# Altium project main.PrjPcb (part 1 of 2)
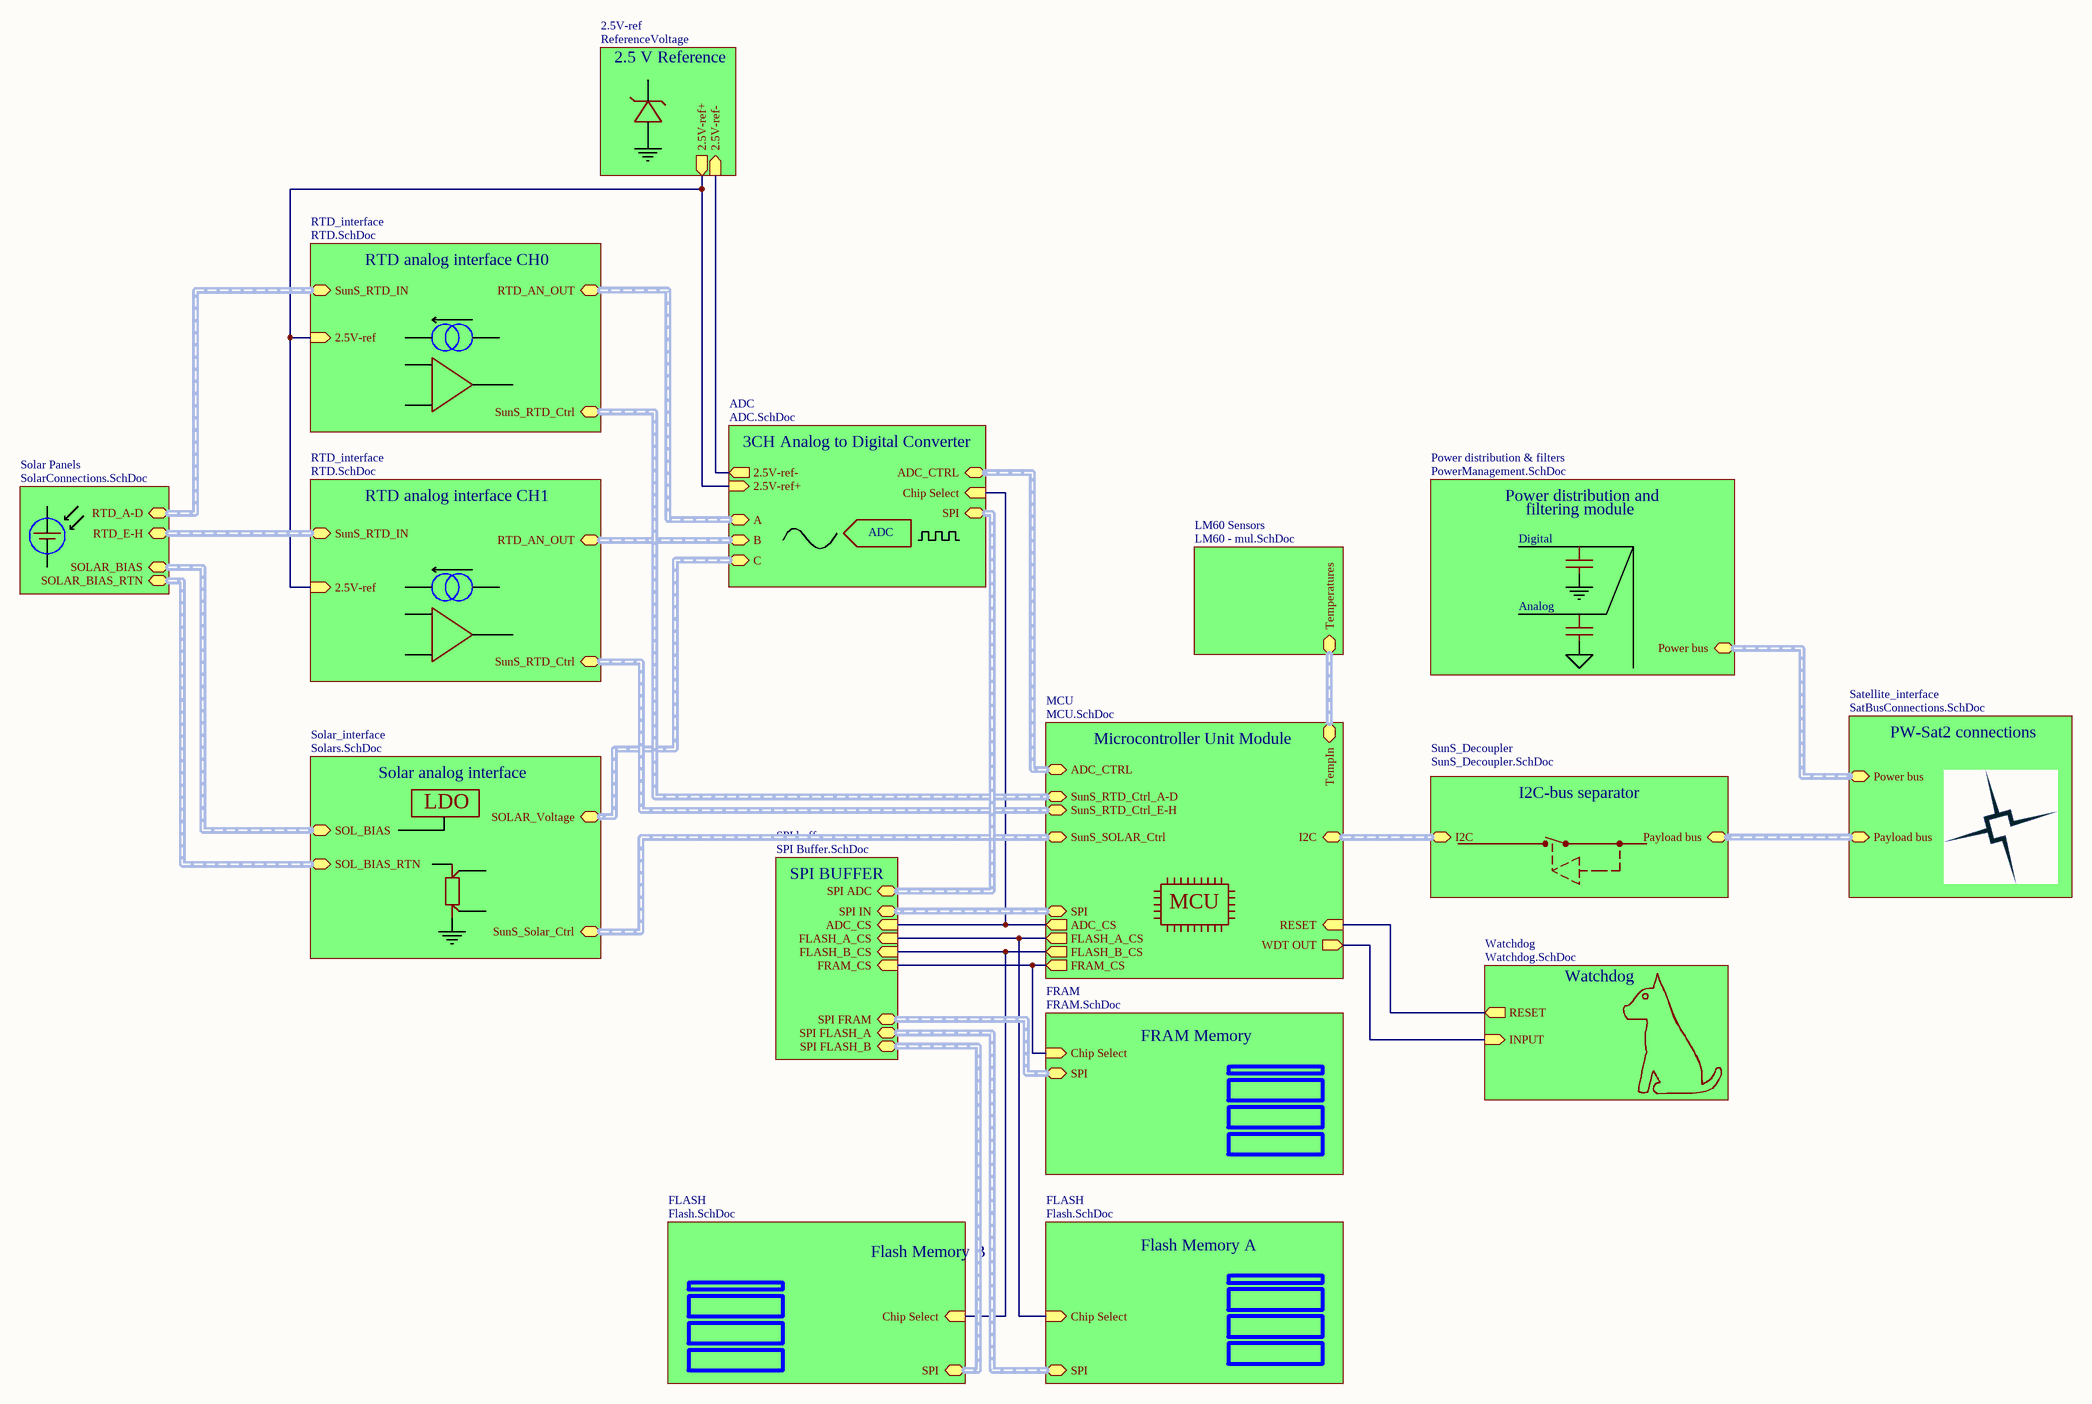
[diagram p0: Top.SchDoc]
17 sheets, 278 parts. Net scope: hierarchical (ports join the sheet entries above them; power ports are global).
Board file: main.PcbDoc
Sheets:
  Top.SchDoc
    MCU = MCU.SchDoc
    Solar Panels = SolarConnections.SchDoc
    Satellite_interface = SatBusConnections.SchDoc
    RTD_interface = RTD.SchDoc
    Solar_interface = Solars.SchDoc
      Current_Limit_CH0 = Current_Limit.SchDoc
      Current_Limit_CH1 = Current_Limit.SchDoc
      Current_Limit_CH2 = Current_Limit.SchDoc
      Current_Limit_CH3 = Current_Limit.SchDoc
    2.5V-ref = ReferenceVoltage.SchDoc
    ADC = ADC.SchDoc
    RTD_interface = RTD.SchDoc
    Power distribution & filters = PowerManagement.SchDoc
    SunS_Decoupler = SunS_Decoupler.SchDoc
    FRAM = FRAM.SchDoc
    FLASH = Flash.SchDoc
    FLASH = Flash.SchDoc
    Watchdog = Watchdog.SchDoc
    SPI buffer = SPI Buffer.SchDoc
    LM60 Sensors = LM60 - mul.SchDoc
      LM601 = LM60.SchDoc
      LM602 = LM60.SchDoc
      LM603 = LM60.SchDoc
      LM604 = LM60.SchDoc

## Sheet Top.SchDoc: SunS - General Block Diagram
size A2; Author: Grzegorz Gajoch; DocumentNumber: 10; SheetNumber: 10; SheetTotal: 16; Model: EM1; PageSetup: Record=PageOptions|CenterHorizontal=True|CenterVertical=True|PrintScale=0.73|XCorrection=1.00|YCorrection=1.00|PrintKind=1|BorderSize=5000000|LeftOffset=0|BottomOffset=0|Orientation=2|PaperLength=4200|PaperWidth=2970|Scale=100|PaperSource=15|PrintQuality=1200|MediaType=1|DitherType=10|PrintScaleMode=1|PaperKind=A3|PaperIndex=8; ResSerDig: 100

### Sub-sheets
2.5V-ref = ReferenceVoltage: 2.5V-ref+ (out), 2.5V-ref- (in)
ADC = ADC.SchDoc: ADC_CTRL (harness ADC_DIG), 2.5V-ref+ (in), 2.5V-ref- (out), A (harness ADC_IN), B (harness ADC_IN), C (harness ADC_IN), Chip Select (in), SPI (harness SPI)
FLASH = Flash.SchDoc: SPI (harness SPI), Chip Select (in)
FLASH = Flash.SchDoc: SPI (harness SPI), Chip Select (in)
FRAM = FRAM.SchDoc: SPI (harness SPI), Chip Select (in)
LM60 Sensors = LM60 - mul.SchDoc: Temperatures (harness LM60)
MCU = MCU.SchDoc: SunS_RTD_Ctrl_A-D (harness MUX_Control), I2C (harness I2C), SunS_RTD_Ctrl_E-H (harness MUX_Control), ADC_CTRL (harness ADC_DIG), SPI (harness SPI), FRAM_CS (out), ADC_CS (out), FLASH_A_CS (out), FLASH_B_CS (out), RESET (in), WDT OUT (out), SunS_SOLAR_Ctrl (harness SunS_Solar_Ctrl), TempIn (harness LM60)
Power distribution & filters = PowerManagement.SchDoc: Power bus (harness Sat_Power)
RTD_interface = RTD.SchDoc: 2.5V-ref (in), SunS_RTD_Ctrl (harness MUX_Control), SunS_RTD_IN (harness SunS_RTD_Conn), RTD_AN_OUT (harness ADC_IN)
RTD_interface = RTD.SchDoc: 2.5V-ref (in), SunS_RTD_Ctrl (harness MUX_Control), SunS_RTD_IN (harness SunS_RTD_Conn), RTD_AN_OUT (harness ADC_IN)
Satellite_interface = SatBusConnections.SchDoc: Payload bus (harness Payload bus), Power bus (harness Sat_Power)
Solar Panels = SolarConnections.SchDoc: RTD_A-D, SOLAR_BIAS (harness Solar_Conn), RTD_E-H, SOLAR_BIAS_RTN (harness Solar_Conn)
Solar_interface = Solars.SchDoc: SOLAR_Voltage (harness ADC_IN), SOL_BIAS (harness Solar_Conn), SunS_Solar_Ctrl (harness SunS_Solar_Ctrl), SOL_BIAS_RTN (harness Solar_Conn)
SPI buffer = SPI Buffer.SchDoc: SPI IN (harness SPI), SPI FRAM (harness SPI), SPI FLASH_A (harness SPI), SPI FLASH_B (harness SPI), SPI ADC (harness SPI), FRAM_CS (in), FLASH_B_CS (in), FLASH_A_CS (in), ADC_CS (in)
SunS_Decoupler = SunS_Decoupler.SchDoc: Payload bus (harness Payload bus), I2C (harness I2C)
Watchdog = Watchdog.SchDoc: RESET (out), INPUT (in)

### Nets
2.5V-ref: sheet RTD_interface/2.5V-ref, sheet 2.5V-ref/2.5V-ref+, sheet ADC/2.5V-ref+, sheet RTD_interface/2.5V-ref
AT_NRST: sheet MCU/RESET, sheet Watchdog/RESET
CS_ADC_I: sheet MCU/ADC_CS, sheet ADC/Chip Select, sheet SPI buffer/ADC_CS
CS_FLASH_A_I: sheet MCU/FLASH_A_CS, sheet FLASH/Chip Select, sheet SPI buffer/FLASH_A_CS
CS_FLASH_B_I: sheet MCU/FLASH_B_CS, sheet FLASH/Chip Select, sheet SPI buffer/FLASH_B_CS
CS_FRAM_I: sheet MCU/FRAM_CS, sheet FRAM/Chip Select, sheet SPI buffer/FRAM_CS
NetU4_25: sheet MCU/WDT OUT, sheet Watchdog/INPUT
(unnamed): sheet 2.5V-ref/2.5V-ref-, sheet ADC/2.5V-ref-

### Buses and harness runs
harness sheet ADC/A = sheet RTD_interface/RTD_AN_OUT
harness sheet ADC/ADC_CTRL = sheet MCU/ADC_CTRL
harness sheet ADC/B = sheet RTD_interface/RTD_AN_OUT
harness sheet ADC/C = sheet Solar_interface/SOLAR_Voltage
harness sheet ADC/SPI = sheet SPI buffer/SPI ADC
harness sheet FLASH/SPI = sheet SPI buffer/SPI FLASH_A
harness sheet FLASH/SPI = sheet SPI buffer/SPI FLASH_B
harness sheet FRAM/SPI = sheet SPI buffer/SPI FRAM
harness sheet LM60 Sensors/Temperatures = sheet MCU/TempIn
harness sheet MCU/I2C = sheet SunS_Decoupler/I2C
harness sheet MCU/SPI = sheet SPI buffer/SPI IN
harness sheet MCU/SunS_RTD_Ctrl_A-D = sheet RTD_interface/SunS_RTD_Ctrl
harness sheet MCU/SunS_RTD_Ctrl_E-H = sheet RTD_interface/SunS_RTD_Ctrl
harness sheet MCU/SunS_SOLAR_Ctrl = sheet Solar_interface/SunS_Solar_Ctrl
harness sheet Power distribution & filters/Power bus = sheet Satellite_interface/Power bus
harness sheet RTD_interface/SunS_RTD_IN = sheet Solar Panels/RTD_A-D
harness sheet RTD_interface/SunS_RTD_IN = sheet Solar Panels/RTD_E-H
harness sheet Satellite_interface/Payload bus = sheet SunS_Decoupler/Payload bus
harness sheet Solar Panels/SOLAR_BIAS = sheet Solar_interface/SOL_BIAS
harness sheet Solar Panels/SOLAR_BIAS_RTN = sheet Solar_interface/SOL_BIAS_RTN

### Notes on the sheet
- 2.5 V Reference
- RTD analog interface CH0
- 3CH Analog to Digital Converter
- RTD analog interface CH1
- ADC
- Power distribution and
- Digital
- filtering module
- Analog
- Microcontroller Unit Module
- PW-Sat2 connections
- Solar analog interface
- LDO
- I2C-bus separator
- SPI BUFFER
- MCU
- Watchdog
- FRAM Memory
- Flash Memory B
- Flash Memory A
- Title:
- Sheet:
- of
- Author:
- Model:
- File name:
- Document Number:
- Checked by:
- Iss-Rev:
- Approved by:
- Date:

## Sheet MCU.SchDoc: AVR processor
size A3; Author: Grzegorz Gajoch; DocumentNumber: 9; SheetNumber: 9; SheetTotal: 16; Model: EM1; PageSetup: Record=PageOptions|CenterHorizontal=True|CenterVertical=True|PrintScale=0.52|XCorrection=1.00|YCorrection=1.00|PrintKind=1|BorderSize=5000000|LeftOffset=0|BottomOffset=0|Orientation=2|PaperLength=4200|PaperWidth=2970|Scale=100|PaperSource=7|PrintQuality=600|MediaType=1|DitherType=10|PaperKind=A3|PrintScaleMode=1
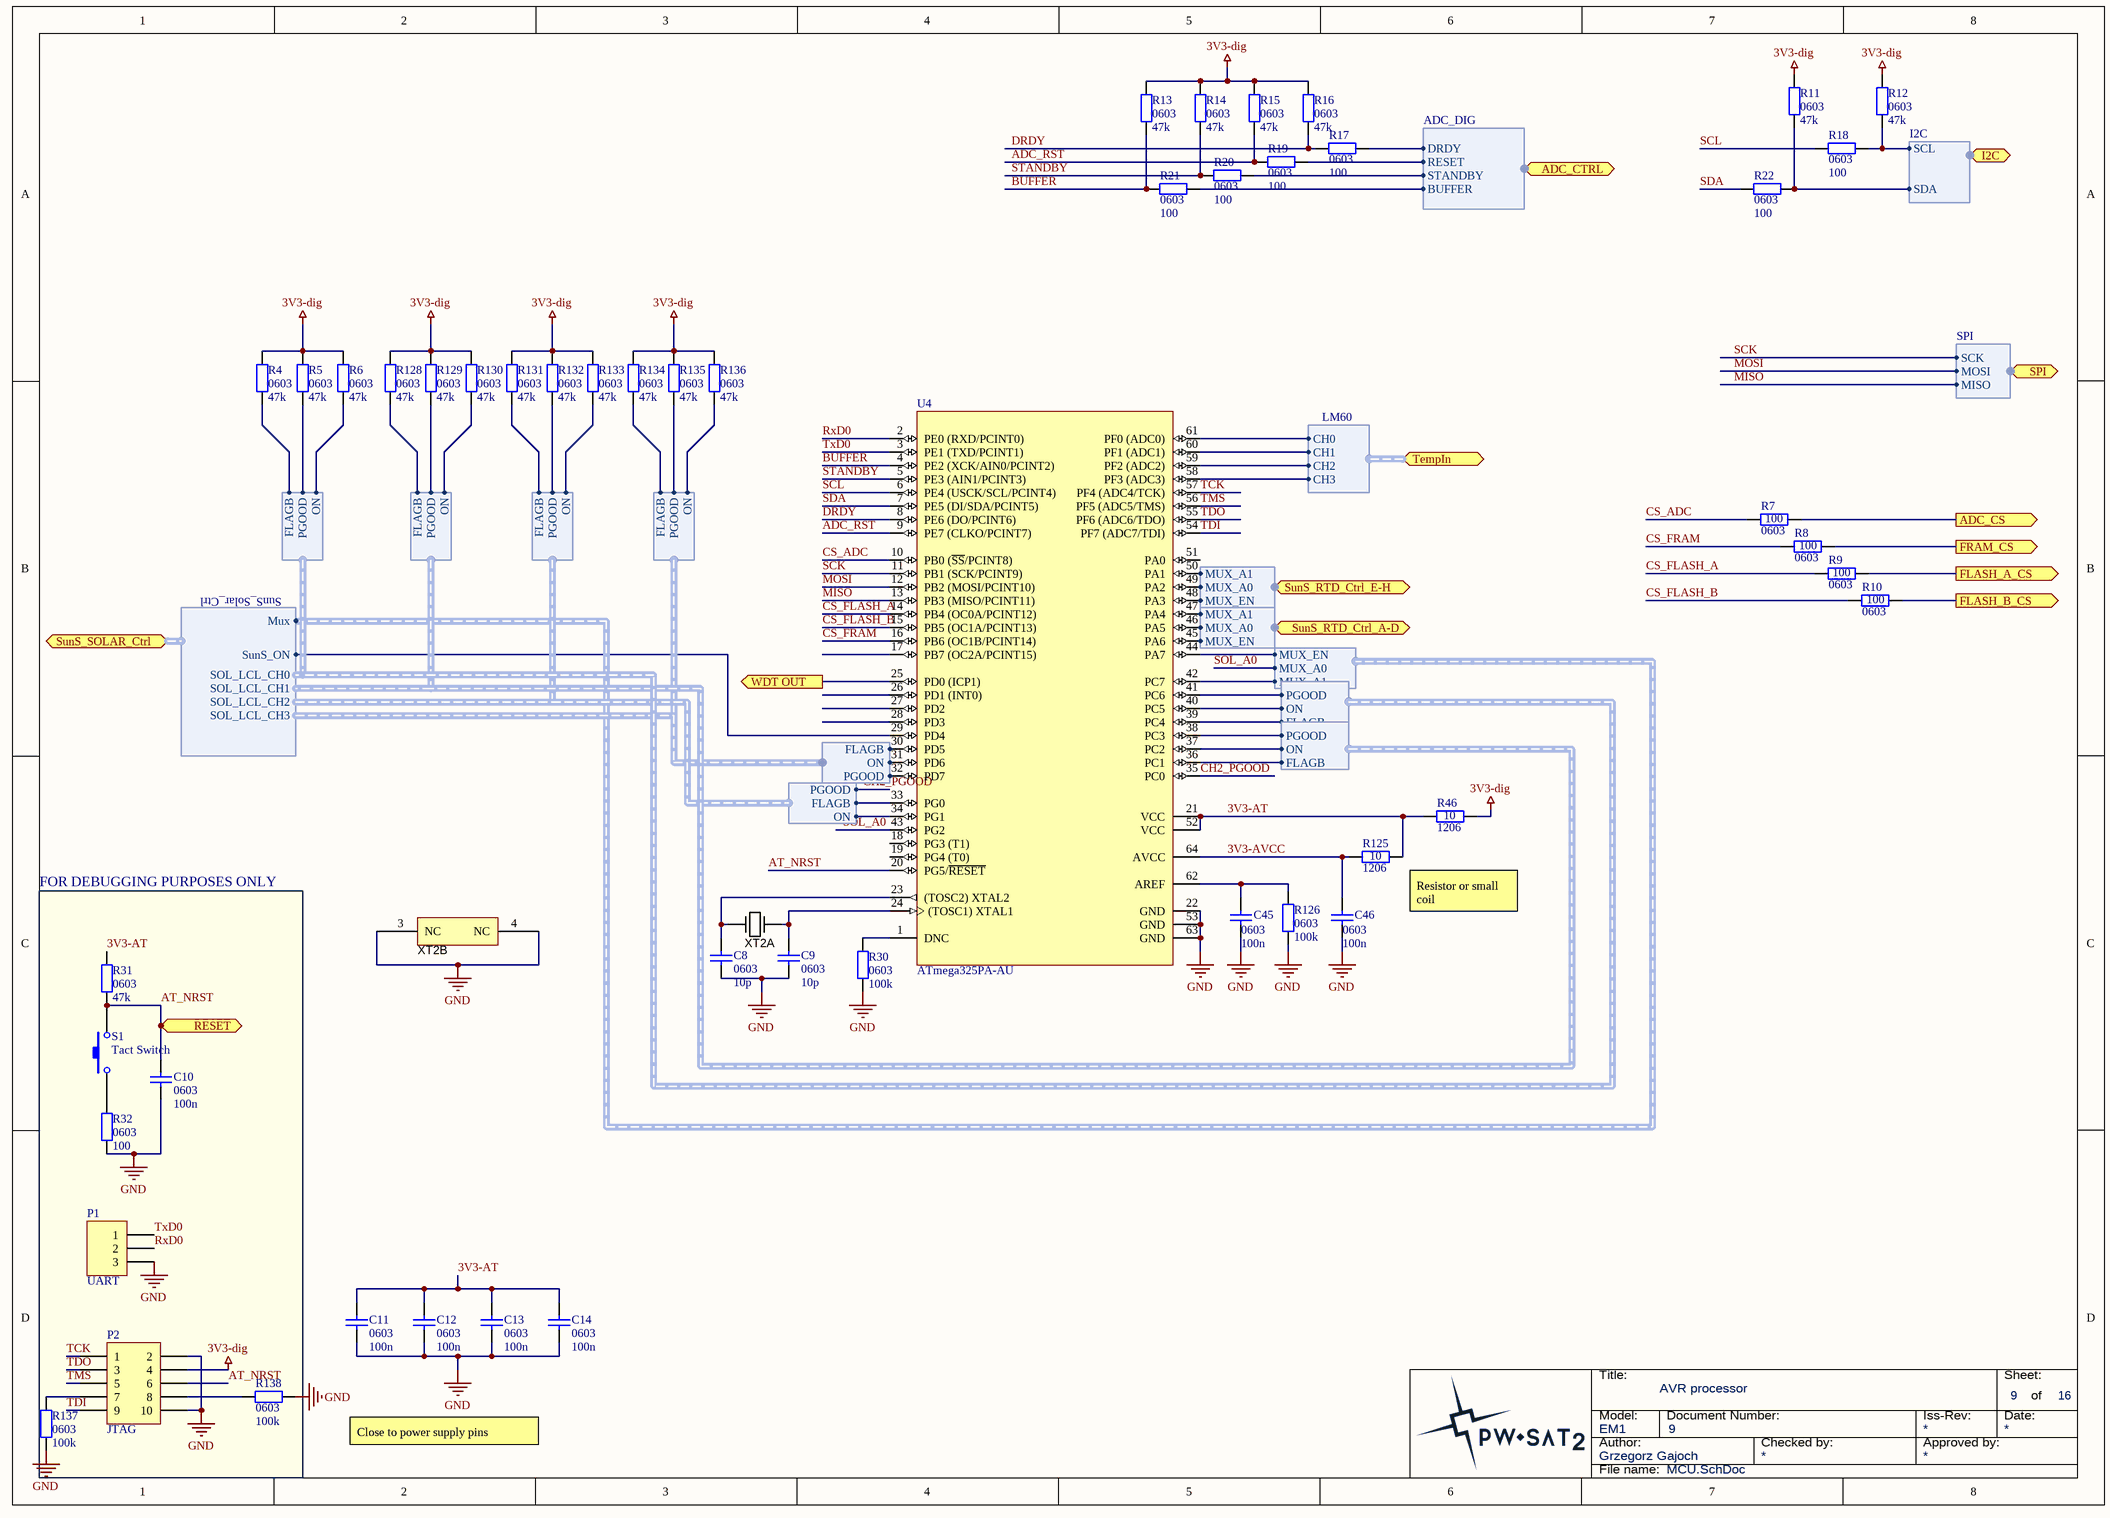
[diagram p1: MCU.SchDoc]

### Parts
C8  0603  value 10p  [SMD_Capacitor_0603]
C9  0603  value 10p  [SMD_Capacitor_0603]
C10  0603  value 100n  [SMD_Capacitor_0603]
C11  0603  value 100n  [SMD_Capacitor_0603]
C12  0603  value 100n  [SMD_Capacitor_0603]
C13  0603  value 100n  [SMD_Capacitor_0603]
C14  0603  value 100n  [SMD_Capacitor_0603]
C45  0603  value 100n  [SMD_Capacitor_0603]
C46  0603  value 100n  [SMD_Capacitor_0603]
P1  UART  [HDR1X3]
P2  JTAG  [HDR2X5]
R4  0603  value 47k  [SMD_Resistor_0603]
R5  0603  value 47k  [SMD_Resistor_0603]
R6  0603  value 47k  [SMD_Resistor_0603]
R7  0603  value 100  [SMD_Resistor_0603]
R8  0603  value 100  [SMD_Resistor_0603]
R9  0603  value 100  [SMD_Resistor_0603]
R10  0603  value 100  [SMD_Resistor_0603]
R11  0603  value 47k  [SMD_Resistor_0603]
R12  0603  value 47k  [SMD_Resistor_0603]
R13  0603  value 47k  [SMD_Resistor_0603]
R14  0603  value 47k  [SMD_Resistor_0603]
R15  0603  value 47k  [SMD_Resistor_0603]
R16  0603  value 47k  [SMD_Resistor_0603]
R17  0603  value 100  [SMD_Resistor_0603]
R18  0603  value 100  [SMD_Resistor_0603]
R19  0603  value 100  [SMD_Resistor_0603]
R20  0603  value 100  [SMD_Resistor_0603]
R21  0603  value 100  [SMD_Resistor_0603]
R22  0603  value 100  [SMD_Resistor_0603]
R30  0603  value 100k  [SMD_Resistor_0603]
R31  0603  value 47k  [SMD_Resistor_0603]
R32  0603  value 100  [SMD_Resistor_0603]
R46  1206  value 10  [SMD_Resistor_1206]
R125  1206  value 10  [SMD_Resistor_1206]
R126  0603  value 100k  [SMD_Resistor_0603]
R128  0603  value 47k  [SMD_Resistor_0603]
R129  0603  value 47k  [SMD_Resistor_0603]
R130  0603  value 47k  [SMD_Resistor_0603]
R131  0603  value 47k  [SMD_Resistor_0603]
R132  0603  value 47k  [SMD_Resistor_0603]
R133  0603  value 47k  [SMD_Resistor_0603]
R134  0603  value 47k  [SMD_Resistor_0603]
R135  0603  value 47k  [SMD_Resistor_0603]
R136  0603  value 47k  [SMD_Resistor_0603]
R137  0603  value 100k  [SMD_Resistor_0603]
R138  0603  value 100k  [SMD_Resistor_0603]
S1  Tact Switch  [Tact Switch 3x6]
U4  ATmega325PA-AU  [64A_N]
XT2  (no value)  [SMD, 5mm x 3.2mm]  (parts A,B of 2)

### Blocks framed on the sheet
FOR DEBUGGING PURPOSES ONLY: C10 P1 P2 R31 R32 R137 R138 S1

### Ports
ADC_CS (out), ADC_CTRL (harness ADC_DIG), FLASH_A_CS (out), FLASH_B_CS (out), FRAM_CS (out), I2C (harness I2C), RESET (in), SPI (harness SPI), SunS_RTD_Ctrl_A-D (harness MUX_Control), SunS_RTD_Ctrl_E-H (harness MUX_Control), SunS_SOLAR_Ctrl (harness SunS_Solar_Ctrl), TempIn (harness LM60), WDT OUT (out)

### Harnesses
MUX_Control: MUX_A0, MUX_A1, MUX_EN
I2C: SCL, SDA
SPI: MOSI, MISO, SCK
ADC_DIG: DRDY, RESET, STANDBY, BUFFER
SunS_Solar_Ctrl: Mux, SunS_ON, SOL_LCL_CH0, SOL_LCL_CH1, SOL_LCL_CH2, SOL_LCL_CH3
LCL_StatCtrl: FLAGB, PGOOD, ON
LM60: CH0, CH1, CH2, CH3

### Nets
3V3-dig: P2.4 R4.2 R5.2 R6.2 R11.2 R12.2 R13.2 R14.2 R15.2 R16.2 R46.1 R128.2 R129.2 R130.2 R131.2 R132.2 R133.2 R134.2 R135.2 R136.2  [project net Vcc3]
GND: C8.1 C9.1 C10.1 C11.1 C12.1 C13.1 C14.1 C45.1 C46.1 P1.3 P2.2 P2.10 R30.1 R32.2 R126.1 R137.1 R138.1 U4.22(GND) U4.53(GND) U4.63(GND) XT2.3(NC) XT2.4(NC)  [project net Ground1]
3V3-AT: C11.2 C12.2 C13.2 C14.2 R31.2 R46.2 R125.2 U4.21(VCC) U4.52(VCC)
3V3-AVCC: C46.2 R125.1 U4.64(AVCC)
ADC_RST: R15.1 R19.1 U4.9(PE7_(CLKO/PCINT7))
AT_NRST: C10.2 P2.6 R31.1 S1.2 U4.20(PG5/~{RESET}) ; port RESET
BUFFER: R13.1 R21.1 U4.4(PE2_(XCK/AIN0/PCINT2))
CH2_PGOOD: R132.1 U4.35(PC0) ; harness LCL_StatCtrl.PGOOD
CS_ADC: R7.2 U4.10(PB0_(~{SS}/PCINT8))
CS_ADC_I: R7.1 ; port ADC_CS
CS_FLASH_A: R9.2 U4.14(PB4_(OC0A/PCINT12))
CS_FLASH_A_I: R9.1 ; port FLASH_A_CS
CS_FLASH_B: R10.2 U4.15(PB5_(OC1A/PCINT13))
CS_FLASH_B_I: R10.1 ; port FLASH_B_CS
CS_FRAM: R8.2 U4.16(PB6_(OC1B/PCINT14))
CS_FRAM_I: R8.1 ; port FRAM_CS
DRDY: R16.1 R17.1 U4.8(PE6_(DO/PCINT6))
FLAGB: R134.1 U4.30(PD5) ; harness LCL_StatCtrl.FLAGB
FLAGB: R131.1 U4.33(PG0) ; harness LCL_StatCtrl.FLAGB  [a separate net that carries the same name]
FLAGB: R128.1 U4.36(PC1) ; harness LCL_StatCtrl.FLAGB  [a separate net that carries the same name]
FLAGB: R4.1 U4.39(PC4) ; harness LCL_StatCtrl.FLAGB  [a separate net that carries the same name]
MISO: U4.13(PB3_(MISO/PCINT11)) ; port SPI.MISO
MOSI: U4.12(PB2_(MOSI/PCINT10)) ; port SPI.MOSI
ON: R136.1 U4.31(PD6) ; harness LCL_StatCtrl.ON
ON: R133.1 U4.34(PG1) ; harness LCL_StatCtrl.ON  [a separate net that carries the same name]
ON: R130.1 U4.37(PC2) ; harness LCL_StatCtrl.ON  [a separate net that carries the same name]
ON: R6.1 U4.40(PC5) ; harness LCL_StatCtrl.ON  [a separate net that carries the same name]
PGOOD: R135.1 U4.32(PD7) ; harness LCL_StatCtrl.PGOOD
PGOOD: R129.1 U4.38(PC3) ; harness LCL_StatCtrl.PGOOD  [a separate net that carries the same name]
PGOOD: R5.1 U4.41(PC6) ; harness LCL_StatCtrl.PGOOD  [a separate net that carries the same name]
RxD0: P1.2 U4.2(PE0_(RXD/PCINT0))
SCK: U4.11(PB1_(SCK/PCINT9)) ; port SPI.SCK
SCL: R18.1 U4.6(PE4_(USCK/SCL/PCINT4))
SDA: R22.1 U4.7(PE5_(DI/SDA/PCINT5))
SOL_A0: U4.43(PG2) ; harness MUX_Control.MUX_A0
STANDBY: R14.1 R20.1 U4.5(PE3_(AIN1/PCINT3))
TCK: P2.1 U4.57(PF4_(ADC4/TCK))
TDI: P2.9 U4.54(PF7_(ADC7/TDI))
TDO: P2.3 U4.55(PF6_(ADC6/TDO))
Temp1: U4.61(PF0_(ADC0)) ; port TempIn.CH0
Temp2: U4.60(PF1_(ADC1)) ; port TempIn.CH1
Temp3: U4.59(PF2_(ADC2)) ; port TempIn.CH2
Temp4: U4.58(PF3_(ADC3)) ; port TempIn.CH3
TMS: P2.5 U4.56(PF5_(ADC5/TMS))
TxD0: P1.1 U4.3(PE1_(TXD/PCINT1))
NetC8_2: C8.2 U4.23((TOSC2)_XTAL2) XT2.1(IN)
NetC9_2: C9.2 U4.24((TOSC1)_XTAL1) XT2.2(OUT)
NetC45_2: C45.2 R126.2 U4.62(AREF)
NetP2_7: P2.7 R137.2
NetP2_8: P2.8 R138.2
NetR11_1: R11.1 R22.2 ; port I2C.SDA
NetR12_1: R12.1 R18.2 ; port I2C.SCL
NetR17_2: R17.2 ; port ADC_CTRL.DRDY
NetR19_2: R19.2 ; port ADC_CTRL.RESET
NetR20_2: R20.2 ; port ADC_CTRL.STANDBY
NetR21_2: R21.2 ; port ADC_CTRL.BUFFER
NetR30_2: R30.2 U4.1(DNC)
NetR32_1: R32.1 S1.1
NetR58_RTD_interface#1_2: U4.46(PA5) ; port SunS_RTD_Ctrl_A-D.MUX_A0
NetR58_RTD_interface#2_2: U4.49(PA2) ; port SunS_RTD_Ctrl_E-H.MUX_A0
NetR59_RTD_interface#1_2: U4.47(PA4) ; port SunS_RTD_Ctrl_A-D.MUX_A1
NetR59_RTD_interface#2_2: U4.50(PA1) ; port SunS_RTD_Ctrl_E-H.MUX_A1
NetR60_RTD_interface#1_2: U4.45(PA6) ; port SunS_RTD_Ctrl_A-D.MUX_EN
NetR60_RTD_interface#2_2: U4.48(PA3) ; port SunS_RTD_Ctrl_E-H.MUX_EN
NetR68_2: U4.42(PC7) ; harness MUX_Control.MUX_A1
NetR69_2: U4.44(PA7) ; harness MUX_Control.MUX_EN
NetR73_2: U4.29(PD4) ; port SunS_SOLAR_Ctrl.SunS_ON
NetU4_25: U4.25(PD0_(ICP1)) ; port WDT OUT

Not connected (* = marked no-connect by the designer): U4 17(PB7_(OC2A/PCINT15)) 18(PG3_(T1)) 19(PG4_(T0)) 26(PD1_(INT0)) 27(PD2) 28(PD3) 51(PA0)

### Notes on the sheet
- (near R125) Resistor or small coil
- Close to power supply pins
- Title:
- Sheet:
- of
- Author:
- Model:
- Document Number:
- Checked by:
- Iss-Rev:
- Approved by:
- Date:
- File name:

### Library data of the parts
C8 C9 = Cap1: Capacitor; Published: 8-Jun-2000; LatestRevisionDate: 17-Jul-2002; LatestRevisionNote: Re-released for DXP Platform.; PackageReference: RAD-0.3; Publisher: Altium Limited; PackageDescription: Radial Cap, Thru-Hole; 2 Leads; 0.3 in Pin Spacing
C10-C14 C45 C46 = Cap: Capacitor; Published: 8-Jun-2000; LatestRevisionDate: 17-Jul-2002; LatestRevisionNote: Re-released for DXP Platform.; PackageReference: RAD-0.3; Publisher: Altium Limited; PackageDescription: Radial Cap, Thru-Hole; 2 Leads; 0.3 in Pin Spacing
P1 = Header 3: Header, 3-Pin; LatestRevisionDate: 17-Jul-2002; LatestRevisionNote: Re-released for DXP Platform.; Publisher: Altium Limited
P2 = Header 5X2: Header, 5-Pin, Dual row; LatestRevisionDate: 17-Jul-2002; LatestRevisionNote: Re-released for DXP Platform.; Publisher: Altium Limited
R4-R22 R30-R32 R46 R125 R126 R128-R138 = Res2: Resistor; Published: 8-Jun-2000; LatestRevisionDate: 17-Jul-2002; LatestRevisionNote: Re-released for DXP Platform.; PackageReference: AXIAL-0.4; Publisher: Altium Limited; PackageDescription: Axial Device, Thru-Hole; 2 Leads; 0.4 in Pin Spacing
S1 = TactSwitch: Supplier 1: Farnell
U4 = ATmega325PA-AU: 8-bit AVR Microcontroller, 1.5-5.5V, 32KB Flash, 1KB EEPROM, 2KB SRAM, 64-pin TQFP, Industrial Grade (-40°C to 85°C); DatasheetVersion: revD, Jun-2011; PackageVersion: revC, Oct-2010; PackageReference: 64A; PackageDescription: 64-Pin Plastic Thin Profile Quad Flat Pack, 14 x 14 x 1.0 mm Body, 0.8 mm Pitch (TQFP); Code_JEDEC: MS-026-AEB; ComponentLink1Description: Manufacturer URL; ComponentLink1URL: http://www.atmel.com/; ComponentLink2Description: ATmega165A/PA/325A/PA/3250A/PA/645A/P/6450A/P Datasheet; ComponentLink2URL: http://www.atmel.com/dyn/resources/prod_documents/doc8285.pdf; ComponentLink3Description: ATmega165A/PA/325A/PA/3250A/PA/645A/P/6450A/P Summary; ComponentLink3URL: http://www.atmel.com/dyn/resources/prod_documents/8285S.pdf
XT2 = Crystal_SMD: Resonator Ceramic; Manufacturer 1: Citizen Finetech Miyota; Manufacturer Part Number 1: CMR309T-6.000MABJ-UT; Ratings: 6.00 MHz; Frequency: 6MHz; Frequency Stability: ±50ppm; Frequency Tolerance: ±30ppm; Load Capacitance: 18pF; Operating Mode: Fundamental; SCDType: spec; Package / Case: Cylindrical Can, Radial; Type: MHz Crystal; Operating Temperature: -10°C ~ 60°C; Mounting Type: Surface Mount; Size / Dimension: 0.118" Dia x 0.346" L (3.00mm x 8.80mm); Height: 0.122" (3.10mm); Supplier 1: Digi-Key; Supplier Part Number 1: 300-8348-1-ND; Tolerance: ±50ppm; ComponentLink1URL: http://media.digikey.com/pdf/Data%20Sheets/Citizen%20PDFs/CMR310T%20CMR309T.pdf; ComponentLink1Description: http://media.digikey.com/pdf/Data%20Sheets/Citizen%20PDFs/CMR310T%20CMR309T.pdf

## Sheet SolarConnections.SchDoc: Solar Panels Connections
size A4; Author: Michał Gumiela; DocumentNumber: 5; SheetNumber: 5; SheetTotal: 16; Model: EM1; PageSetup: Record=PageOptions|CenterHorizontal=True|CenterVertical=True|PrintScale=0.52|XCorrection=1.00|YCorrection=1.00|PrintKind=1|BorderSize=5000000|LeftOffset=0|BottomOffset=0|Orientation=2|PaperLength=4200|PaperWidth=2970|Scale=100|PaperSource=7|PrintQuality=600|MediaType=1|DitherType=10|PaperKind=A3|PrintScaleMode=1
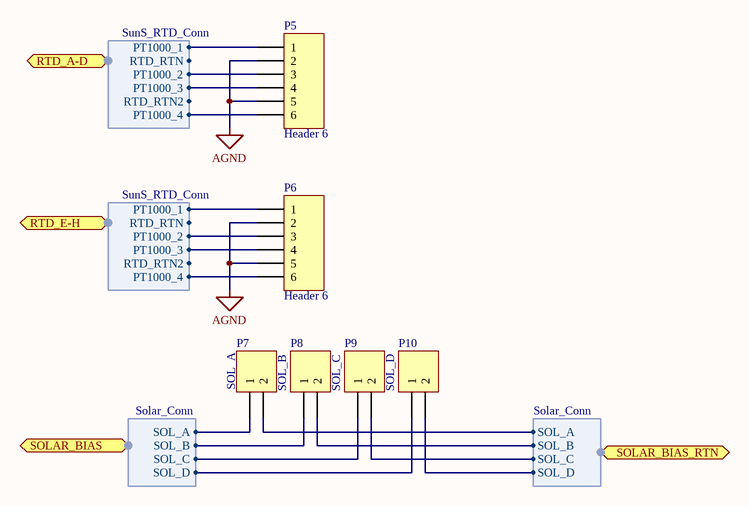
[diagram p2: SolarConnections.SchDoc]

### Parts
P5  Header 6  [HDR1X6]
P6  Header 6  [HDR1X6]
P7  SOL_A  [HDR1X2]
P8  SOL_B  [HDR1X2]
P9  SOL_C  [HDR1X2]
P10  SOL_D  [HDR1X2]

### Ports
RTD_A-D (harness SunS_RTD_Conn), RTD_E-H (harness SunS_RTD_Conn), SOLAR_BIAS (harness Solar_Conn), SOLAR_BIAS_RTN (harness Solar_Conn)

### Harnesses
Solar_Conn: SOL_A, SOL_B, SOL_C, SOL_D
SunS_RTD_Conn: PT1000_1, PT1000_2, PT1000_3, PT1000_4, RTD_RTN2, RTD_RTN

### Nets
AGND: P5.2 P5.5 P6.2 P6.5  [project net Ground1]
NetP5_1: P5.1 ; port RTD_A-D.PT1000_1
NetP5_3: P5.3 ; port RTD_A-D.PT1000_2
NetP5_4: P5.4 ; port RTD_A-D.PT1000_3
NetP5_6: P5.6 ; port RTD_A-D.PT1000_4
NetP6_1: P6.1 ; port RTD_E-H.PT1000_1
NetP6_3: P6.3 ; port RTD_E-H.PT1000_2
NetP6_4: P6.4 ; port RTD_E-H.PT1000_3
NetP6_6: P6.6 ; port RTD_E-H.PT1000_4
NetP7_1: P7.1 ; port SOLAR_BIAS.SOL_A
NetP7_2: P7.2 ; port SOLAR_BIAS_RTN.SOL_A
NetP8_1: P8.1 ; port SOLAR_BIAS.SOL_B
NetP8_2: P8.2 ; port SOLAR_BIAS_RTN.SOL_B
NetP9_1: P9.1 ; port SOLAR_BIAS.SOL_C
NetP9_2: P9.2 ; port SOLAR_BIAS_RTN.SOL_C
NetP10_1: P10.1 ; port SOLAR_BIAS.SOL_D
NetP10_2: P10.2 ; port SOLAR_BIAS_RTN.SOL_D
(unnamed): port RTD_E-H.RTD_RTN2, port RTD_E-H.RTD_RTN
(unnamed): port RTD_A-D.RTD_RTN2, port RTD_A-D.RTD_RTN

### Notes on the sheet
- Title:
- Sheet:
- of
- Author:
- Model:
- Document Number:
- Checked by:
- Iss-Rev:
- Approved by:
- Date:
- File name:

### Library data of the parts
P5 P6 = Header 6: Header, 6-Pin; LatestRevisionDate: 17-Jul-2002; LatestRevisionNote: Re-released for DXP Platform.; Publisher: Altium Limited
P7-P10 = Header 2: Header, 2-Pin; LatestRevisionDate: 17-Jul-2002; LatestRevisionNote: Re-released for DXP Platform.; Publisher: Altium Limited

## Sheet SatBusConnections.SchDoc: SunS - PW-Sat2 connections
size A3; Author: Michał Gumiela; DocumentNumber: 16; SheetNumber: 16; SheetTotal: 16; Model: EM1; PageSetup: Record=PageOptions|CenterHorizontal=True|CenterVertical=True|PrintScale=0.52|XCorrection=1.00|YCorrection=1.00|PrintKind=1|BorderSize=5000000|LeftOffset=0|BottomOffset=0|Orientation=2|PaperLength=4200|PaperWidth=2970|Scale=100|PaperSource=7|PrintQuality=600|MediaType=1|DitherType=10|PaperKind=A3|PrintScaleMode=1
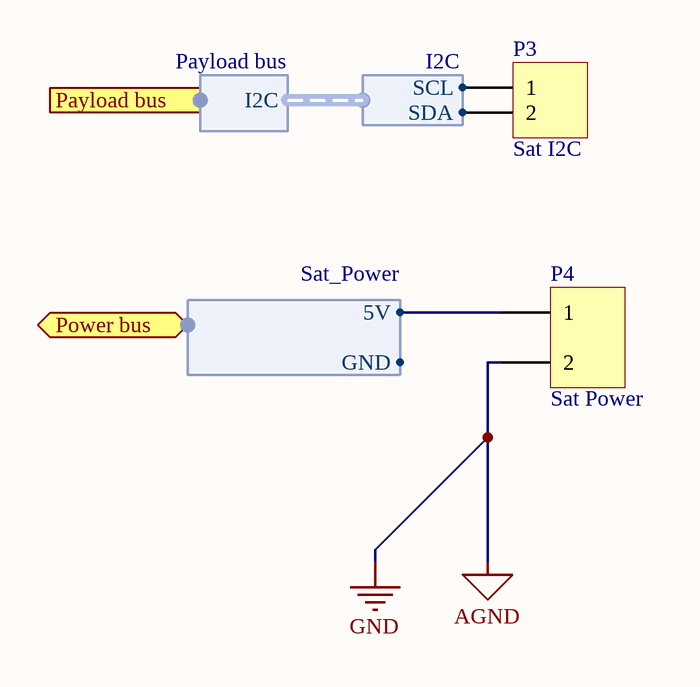
[diagram p3: SatBusConnections.SchDoc]

### Parts
P3  Sat I2C  [HDR1X2]
P4  Sat Power  [HDR1X3]

### Ports
Payload bus (harness Payload bus), Power bus (harness Sat_Power)

### Harnesses
I2C: SCL, SDA
Payload bus: I2C
Sat_Power: 5V, GND

### Nets
AGND: P4.3(2)  [also labelled GND]  [project net Ground1]
5V: P4.1 ; port Power bus.5V
NetP3_1: P3.1 ; harness I2C.SCL
NetP3_2: P3.2 ; harness I2C.SDA

Not connected (* = marked no-connect by the designer): P4 2

### Notes on the sheet
- Title:
- Sheet:
- of
- Author:
- Model:
- Document Number:
- Checked by:
- Iss-Rev:
- Approved by:
- Date:
- File name:

### Library data of the parts
P3 = Header 2: Header, 2-Pin; LatestRevisionDate: 17-Jul-2002; LatestRevisionNote: Re-released for DXP Platform.; Publisher: Altium Limited
P4 = Header 3: Header, 3-Pin; LatestRevisionDate: 17-Jul-2002; LatestRevisionNote: Re-released for DXP Platform.; Publisher: Altium Limited

## Sheet RTD.SchDoc: RTD analog interface
size A3; Author: M. Gumiela, G. Gajoch; DocumentNumber: 2; SheetNumber: 2; SheetTotal: 16; Model: EM1; PageSetup: Record=PageOptions|CenterHorizontal=True|CenterVertical=True|PrintScale=0.52|XCorrection=1.00|YCorrection=1.00|PrintKind=1|BorderSize=5000000|LeftOffset=0|BottomOffset=0|Orientation=2|PaperLength=4200|PaperWidth=2970|Scale=100|PaperSource=7|PrintQuality=600|MediaType=1|DitherType=10|PaperKind=A3|PrintScaleMode=1
Used 2 times, as channels RTD_interface, RTD_interface. Parts and nets are listed once, with the designators drawn on the sheet.
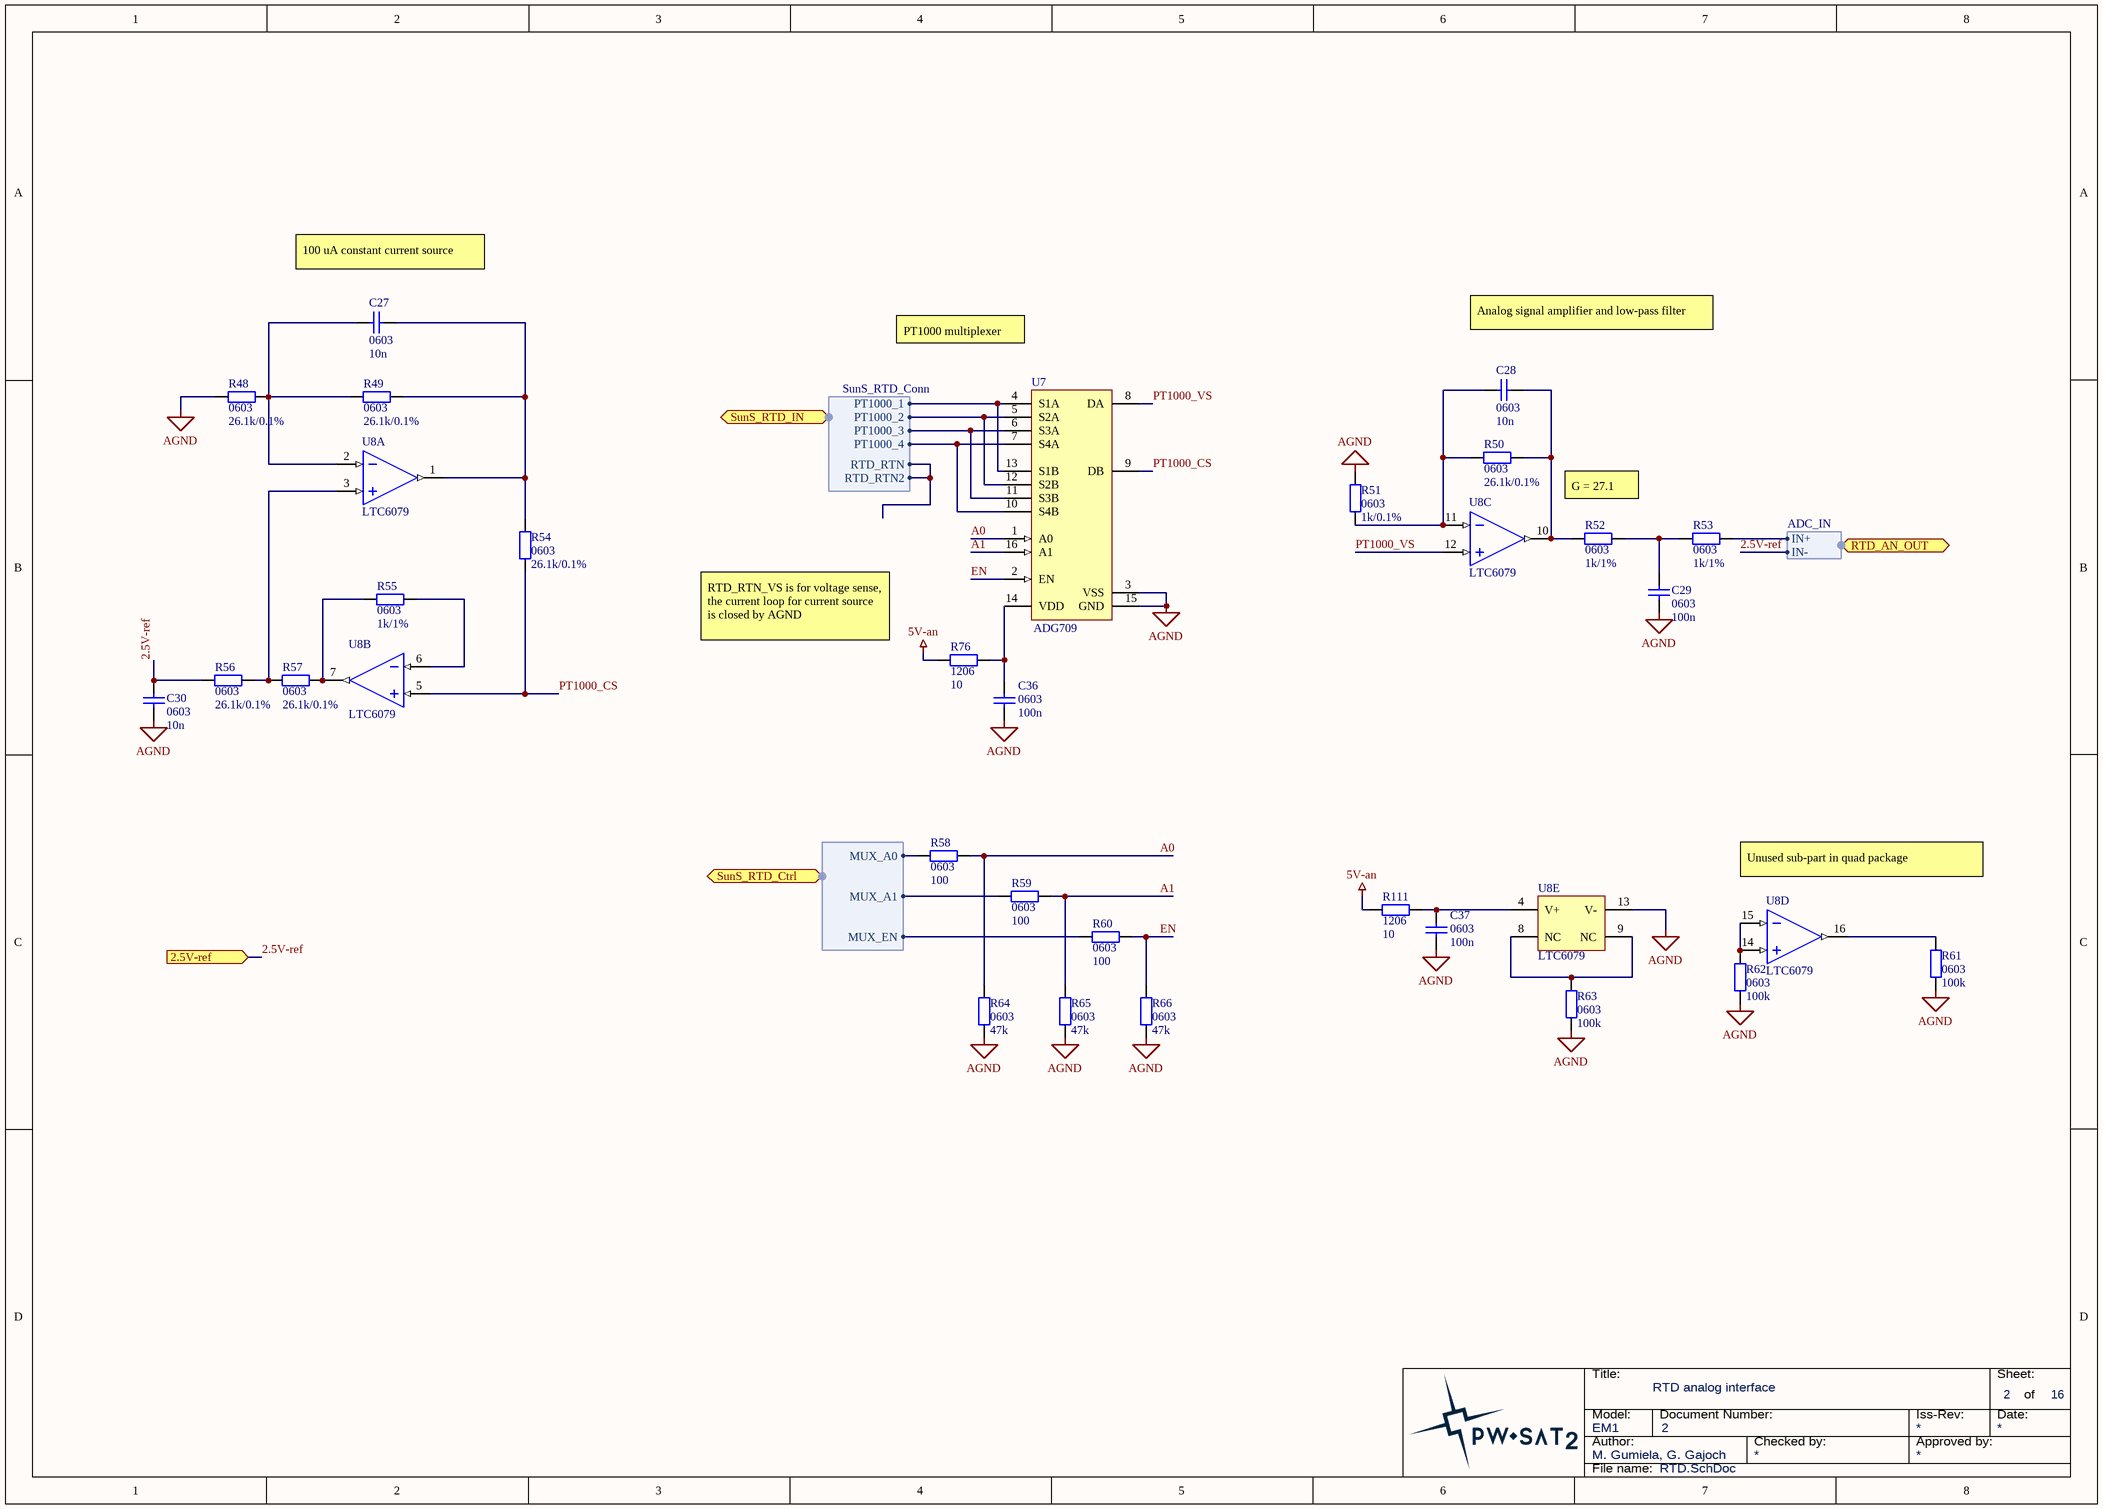
[diagram p4: RTD.SchDoc]

### Parts
C27  0603  value 10n  [SMD_Capacitor_0603]
C28  0603  value 10n  [SMD_Capacitor_0603]
C29  0603  value 100n  [SMD_Capacitor_0603]
C30  0603  value 10n  [SMD_Capacitor_0603]
C36  0603  value 100n  [SMD_Capacitor_0603]
C37  0603  value 100n  [SMD_Capacitor_0603]
R48  0603  value 26.1k/0.1%  [SMD_Resistor_0603]
R49  0603  value 26.1k/0.1%  [SMD_Resistor_0603]
R50  0603  value 26.1k/0.1%  [SMD_Resistor_0603]
R51  0603  value 1k/0.1%  [SMD_Resistor_0603]
R52  0603  value 1k/1%  [SMD_Resistor_0603]
R53  0603  value 1k/1%  [SMD_Resistor_0603]
R54  0603  value 26.1k/0.1%  [SMD_Resistor_0603]
R55  0603  value 1k/1%  [SMD_Resistor_0603]
R56  0603  value 26.1k/0.1%  [SMD_Resistor_0603]
R57  0603  value 26.1k/0.1%  [SMD_Resistor_0603]
R58  0603  value 100  [SMD_Resistor_0603]
R59  0603  value 100  [SMD_Resistor_0603]
R60  0603  value 100  [SMD_Resistor_0603]
R61  0603  value 100k  [SMD_Resistor_0603]
R62  0603  value 100k  [SMD_Resistor_0603]
R63  0603  value 100k  [SMD_Resistor_0603]
R64  0603  value 47k  [SMD_Resistor_0603]
R65  0603  value 47k  [SMD_Resistor_0603]
R66  0603  value 47k  [SMD_Resistor_0603]
R76  1206  value 10  [SMD_Resistor_1206]
R111  1206  value 10  [SMD_Resistor_1206]
U7  ADG709  [TSSOP16]
U8  LTC6079  [SSOP-16]  (parts A,B,C,D,E of 5)

### Ports
2.5V-ref (in), RTD_AN_OUT (harness ADC_IN), SunS_RTD_Ctrl (harness MUX_Control), SunS_RTD_IN (harness SunS_RTD_Conn)

### Harnesses
MUX_Control: MUX_A0, MUX_A1, MUX_EN
ADC_IN: IN+, IN-
SunS_RTD_Conn: PT1000_1, PT1000_2, PT1000_3, PT1000_4, RTD_RTN2, RTD_RTN

### Nets
5V-an: R76.2 R111.2
AGND: C29.1 C30.2 C36.1 C37.1 R48.2 R51.1 R61.2 R62.2 R63.2 R64.2 R65.2 R66.2 U7.3(VSS) U7.15(GND) U8.13(V-)
2.5V-ref: C30.1 R56.2 ; port 2.5V-ref, port RTD_AN_OUT.IN-
A0: R58.1 R64.1 U7.1(A0)
A1: R59.1 R65.1 U7.16(A1)
EN: R60.1 R66.1 U7.2(EN)
PT1000_CS: R54.1 U7.9(DB) U8.5(IN+_B)
PT1000_VS: U7.8(DA) U8.12(IN+_C)
NetC27_1: C27.1 R48.1 R49.2 U8.2(IN-_A)
NetC27_2: C27.2 R49.1 R54.2 U8.1(OUT_A)
NetC28_1: C28.1 R50.1 R51.2 U8.11(IN-_C)
NetC28_2: C28.2 R50.2 R52.2 U8.10(OUT_C)
NetC29_2: C29.2 R52.1 R53.2
NetC36_2: C36.2 R76.1 U7.14(VDD)
NetC37_2: C37.2 R111.1 U8.4(V+)
NetR53_1: R53.1 ; port RTD_AN_OUT.IN+
NetR55_1: R55.1 U8.6(IN-_B)
NetR55_2: R55.2 R57.1 U8.7(OUT_B)
NetR56_1: R56.1 R57.2 U8.3(IN+_A)
NetR58_2: R58.2 ; port SunS_RTD_Ctrl.MUX_A0
NetR59_2: R59.2 ; port SunS_RTD_Ctrl.MUX_A1
NetR60_2: R60.2 ; port SunS_RTD_Ctrl.MUX_EN
NetR61_1: R61.1 U8.16(OUT_D)
NetR62_1: R62.1 U8.14(IN+_D) U8.15(IN-_D)
NetR63_1: R63.1 U8.8(NC) U8.9(NC)
NetU7_4: U7.4(S1A) U7.13(S1B) ; port SunS_RTD_IN.PT1000_1
NetU7_5: U7.5(S2A) U7.12(S2B) ; port SunS_RTD_IN.PT1000_2
NetU7_6: U7.6(S3A) U7.11(S3B) ; port SunS_RTD_IN.PT1000_3
NetU7_7: U7.7(S4A) U7.10(S4B) ; port SunS_RTD_IN.PT1000_4
(unnamed): port SunS_RTD_IN.RTD_RTN2, port SunS_RTD_IN.RTD_RTN

### Channels
RTD_interface: designators end in _RTD_interface#1; ports 2.5V-ref=2.5V-ref
RTD_interface: designators end in _RTD_interface#2; ports 2.5V-ref=2.5V-ref

### Notes on the sheet
- 100 uA constant current source
- PT1000 multiplexer
- Analog signal amplifier and low-pass filter
- G = 27.1
- RTD_RTN_VS is for voltage sense, the current loop for current source is closed by AGND
- Unused sub-part in quad package
- Title:
- Sheet:
- of
- Author:
- Model:
- Document Number:
- Checked by:
- Iss-Rev:
- Approved by:
- Date:
- File name:

### Library data of the parts
C27-C30 = Cap: Capacitor; Published: 8-Jun-2000; LatestRevisionDate: 17-Jul-2002; LatestRevisionNote: Re-released for DXP Platform.; PackageReference: RAD-0.3; Publisher: Altium Limited; PackageDescription: Radial Cap, Thru-Hole; 2 Leads; 0.3 in Pin Spacing
C36 C37 = Cap1: Capacitor; Published: 8-Jun-2000; LatestRevisionDate: 17-Jul-2002; LatestRevisionNote: Re-released for DXP Platform.; PackageReference: RAD-0.3; Publisher: Altium Limited; PackageDescription: Radial Cap, Thru-Hole; 2 Leads; 0.3 in Pin Spacing
R48-R66 R76 R111 = Res2: Resistor; Published: 8-Jun-2000; LatestRevisionDate: 17-Jul-2002; LatestRevisionNote: Re-released for DXP Platform.; PackageReference: AXIAL-0.4; Publisher: Altium Limited; PackageDescription: Axial Device, Thru-Hole; 2 Leads; 0.4 in Pin Spacing
U7 = ADG709: CMOS Analog 4-Channel Multiplexer; Manufacturer: Analog Devices; ManufacturerPartNumber: ADG709
U8 = LTC6079: Rail-to-rail, quad operational amplifier. Library compatible with LTC608X LTC607X op-amps; Manufacturer: Linear Technology; Value: LTC6079

## Sheet Solars.SchDoc: Solar panels analog interface
size A2; Author: G. Gajoch, M. Gumiela; DocumentNumber: 12; SheetNumber: 12; SheetTotal: 16; Rshunt: 15; Model: EM1; PageSetup: Record=PageOptions|CenterHorizontal=True|CenterVertical=True|PrintScale=0.52|XCorrection=1.00|YCorrection=1.00|PrintKind=1|BorderSize=5000000|LeftOffset=0|BottomOffset=0|Orientation=2|PaperLength=4200|PaperWidth=2970|Scale=100|PaperSource=7|PrintQuality=600|MediaType=1|DitherType=10|PaperKind=A3|PrintScaleMode=1
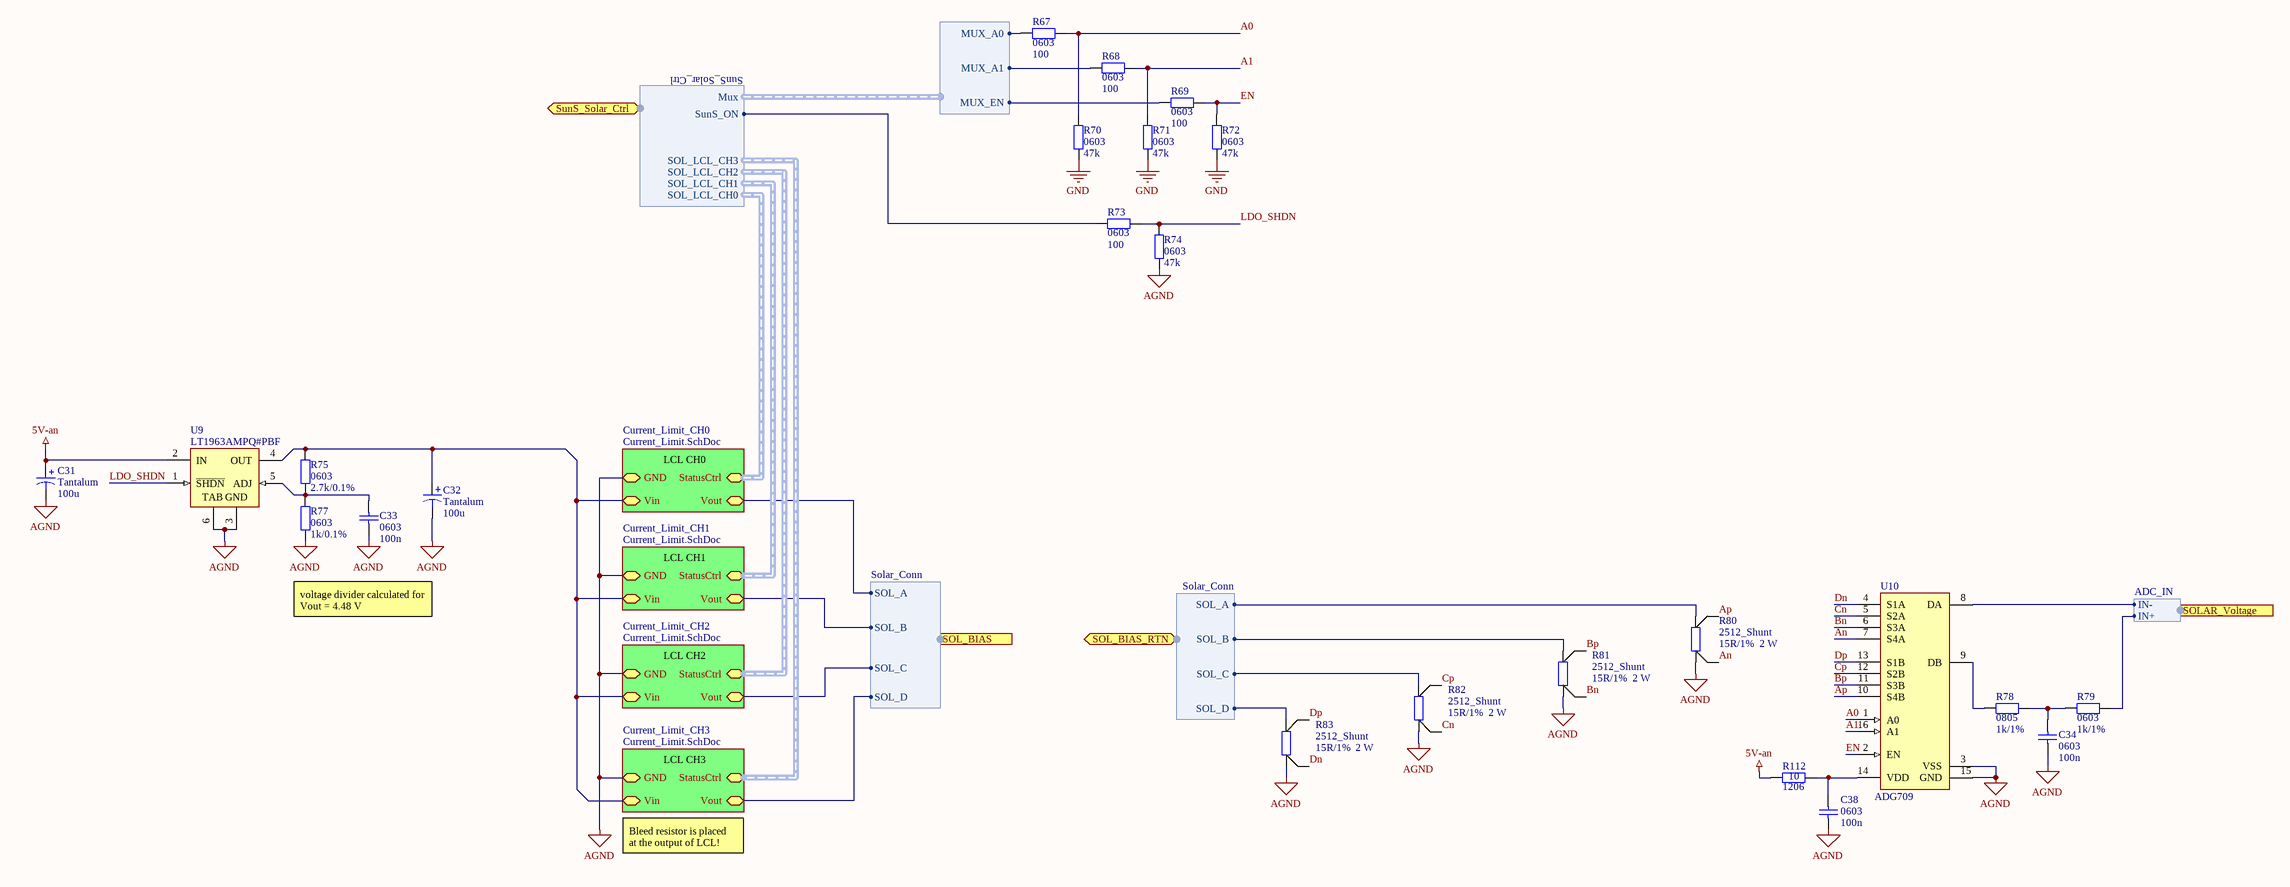
[diagram p5: Solars.SchDoc]

### Parts
C31  Tantalum  value 100u  [Tantalum_cap_D]
C32  Tantalum  value 100u  [Tantalum_cap_D]
C33  0603  value 100n  [SMD_Capacitor_0603]
C34  0603  value 100n  [SMD_Capacitor_0603]
C38  0603  value 100n  [SMD_Capacitor_0603]
R67  0603  value 100  [SMD_Resistor_0603]
R68  0603  value 100  [SMD_Resistor_0603]
R69  0603  value 100  [SMD_Resistor_0603]
R70  0603  value 47k  [SMD_Resistor_0603]
R71  0603  value 47k  [SMD_Resistor_0603]
R72  0603  value 47k  [SMD_Resistor_0603]
R73  0603  value 100  [SMD_Resistor_0603]
R74  0603  value 47k  [SMD_Resistor_0603]
R75  0603  value 2.7k/0.1%  [SMD_Resistor_0603]
R77  0603  value 1k/0.1%  [SMD_Resistor_0603]
R78  0805  value 1k/1%  [SMD_Resistor_0805]
R79  0603  value 1k/1%  [SMD_Resistor_0603]
R80  Power Rating: 2 W  Package: 2512_Shunt  [SMD_Resistor-shunt_2512]  (hidden comment: 15R/1%)
R81  Power Rating: 2 W  Package: 2512_Shunt  [SMD_Resistor-shunt_2512]  (hidden comment: 15R/1%)
R82  Power Rating: 2 W  Package: 2512_Shunt  [SMD_Resistor-shunt_2512]  (hidden comment: 15R/1%)
R83  Power Rating: 2 W  Package: 2512_Shunt  [SMD_Resistor-shunt_2512]  (hidden comment: 15R/1%)
R112  1206  value 10  [SMD_Resistor_1206]
U9  LT1963AMPQ#PBF  [LT-Q-5_N]
U10  ADG709  [TSSOP16]

### Sub-sheets
Current_Limit_CH0 = Current_Limit.SchDoc: GND, Vout, StatusCtrl (harness LCL_StatCtrl), Vin
Current_Limit_CH1 = Current_Limit.SchDoc: GND, Vout, StatusCtrl (harness LCL_StatCtrl), Vin
Current_Limit_CH2 = Current_Limit.SchDoc: GND, Vout, StatusCtrl (harness LCL_StatCtrl), Vin
Current_Limit_CH3 = Current_Limit.SchDoc: GND, Vout, StatusCtrl (harness LCL_StatCtrl), Vin

### Ports
SOL_BIAS (harness Solar_Conn), SOL_BIAS_RTN (harness Solar_Conn), SOLAR_Voltage (harness ADC_IN), SunS_Solar_Ctrl (harness SunS_Solar_Ctrl)

### Harnesses
MUX_Control: MUX_A0, MUX_A1, MUX_EN
SunS_Solar_Ctrl: Mux, SunS_ON, SOL_LCL_CH0, SOL_LCL_CH1, SOL_LCL_CH2, SOL_LCL_CH3
ADC_IN: IN+, IN-
Solar_Conn: SOL_A, SOL_B, SOL_C, SOL_D

### Nets
5V-an: C31.1 R112.2 U9.2(IN)  [project net Vcc1]
AGND: C31.2 C32.2 C33.1 C34.1 C38.1 R70.2 R71.2 R72.2 R74.2 R77.2 R80.1 R81.1 R82.1 R83.1 U9.3(GND) U9.6(TAB) U10.3(VSS) U10.15(GND) ; sheet Current_Limit_CH0/GND, sheet Current_Limit_CH1/GND, sheet Current_Limit_CH2/GND, sheet Current_Limit_CH3/GND  [also labelled GND]  [project net Ground1]
A0: R67.1 R70.1 U10.1(A0)
A1: R68.1 R71.1 U10.16(A1)
An: R80.2 U10.7(S4A)
Ap: R80.3 U10.10(S4B)
Bn: R81.2 U10.6(S3A)
Bp: R81.3 U10.11(S3B)
Cn: R82.2 U10.5(S2A)
Cp: R82.3 U10.12(S2B)
Dn: R83.2 U10.4(S1A)
Dp: R83.3 U10.13(S1B)
EN: R69.1 R72.1 U10.2(EN)
LDO_SHDN: R73.1 R74.1 U9.1(~{SHDN})
SOL_A0: R67.2 ; harness MUX_Control.MUX_A0
NetC32_1: C32.1 R75.2 U9.4(OUT) ; sheet Current_Limit_CH0/Vin, sheet Current_Limit_CH1/Vin, sheet Current_Limit_CH2/Vin, sheet Current_Limit_CH3/Vin
NetC33_2: C33.2 R75.1 R77.1 U9.5(ADJ)
NetC34_2: C34.2 R78.2 R79.1
NetC38_2: C38.2 R112.1 U10.14(VDD)
NetP7_1: sheet Current_Limit_CH0/Vout, port SOL_BIAS.SOL_A
NetP7_2: R80.4 ; port SOL_BIAS_RTN.SOL_A
NetP8_1: sheet Current_Limit_CH1/Vout, port SOL_BIAS.SOL_B
NetP8_2: R81.4 ; port SOL_BIAS_RTN.SOL_B
NetP9_1: sheet Current_Limit_CH2/Vout, port SOL_BIAS.SOL_C
NetP9_2: R82.4 ; port SOL_BIAS_RTN.SOL_C
NetP10_1: sheet Current_Limit_CH3/Vout, port SOL_BIAS.SOL_D
NetP10_2: R83.4 ; port SOL_BIAS_RTN.SOL_D
NetR68_2: R68.2 ; harness MUX_Control.MUX_A1
NetR69_2: R69.2 ; harness MUX_Control.MUX_EN
NetR73_2: R73.2 ; port SunS_Solar_Ctrl.SunS_ON
NetR78_1: R78.1 U10.9(DB)
NetR79_2: R79.2 ; port SOLAR_Voltage.IN+
NetU1_17: U10.8(DA) ; port SOLAR_Voltage.IN-

### Notes on the sheet
- LCL CH0
- LCL CH1
- voltage divider calculated for Vout = 4.48 V
- LCL CH2
- LCL CH3
- Bleed resistor is placed
  at the output of LCL!
- Title:
- Sheet:
- of
- Author:
- Model:
- File name:
- Document Number:
- Checked by:
- Iss-Rev:
- Approved by:
- Date:

### Library data of the parts
C31 C32 = Cap Pol1: Polarized Capacitor (Radial); Published: 8-Jun-2000; LatestRevisionDate: 17-Jul-2002; LatestRevisionNote: Re-released for DXP Platform.; PackageReference: RB7.6-15; Publisher: Altium Limited; PackageDescription: Polarized Capacitor (Radial); 2 Leads
C33 C34 = Cap: Capacitor; Published: 8-Jun-2000; LatestRevisionDate: 17-Jul-2002; LatestRevisionNote: Re-released for DXP Platform.; PackageReference: RAD-0.3; Publisher: Altium Limited; PackageDescription: Radial Cap, Thru-Hole; 2 Leads; 0.3 in Pin Spacing
C38 = Cap1: Capacitor; Published: 8-Jun-2000; LatestRevisionDate: 17-Jul-2002; LatestRevisionNote: Re-released for DXP Platform.; PackageReference: RAD-0.3; Publisher: Altium Limited; PackageDescription: Radial Cap, Thru-Hole; 2 Leads; 0.3 in Pin Spacing
R67-R75 R77-R79 R112 = Res2: Resistor; Published: 8-Jun-2000; LatestRevisionDate: 17-Jul-2002; LatestRevisionNote: Re-released for DXP Platform.; PackageReference: AXIAL-0.4; Publisher: Altium Limited; PackageDescription: Axial Device, Thru-Hole; 2 Leads; 0.4 in Pin Spacing
R80-R83 = 352115RFT: TE CONNECTIVITY  352115RFT  RESISTOR, 2512, 2W, 15R, 1%; Temperature Coefficient: ± 100ppm/°C; Manufacturer: TE CONNECTIVITY; ManufacturerPartNumber: 352115RFT; Farnell: http://pl.farnell.com/te-connectivity/352115rft/resistor-2512-2w-15r-1/dp/2117454; Manufacturer's Datasheet: http://www.farnell.com/datasheets/1610601.pdf; Value: 15R/1%
U9 = LT1963AMPQ#PBF: 1.5 A, Low Noise, Fast Transient Response LDO Regulator, 2.1 to 20 V Vin, Adjustable Vout, 5-pin DPAK (Q-5), -55 to 125 degC, Pb-Free; Manufacturer: Linear Technology; Discrete Pass Element: no; Dropout Voltage(V): 0.34; Iout(mA): 1500; Isupply(mA): 1; Noise(uV): 40; Output Voltage: Adj; PSRR(dB): 63; Shutdown Current(uA): 0.01; Vin Max(V): 20; Vin Min(V): 2.1; Vout Min(V): 1.21; DatasheetVersion: Rev. E; PackageVersion: Rev. F, 09/2011; PackageReference: Q-5; PackageDescription: 5-Pin Plastic DD Pak, Body 10.2235 x 8.89 mm, Pitch 1.702 mm; Supplier 1: Digi-Key; Supplier Part Number 1: LT1963AMPQ#PBF-ND; Supplier 2: Farnell; Supplier Part Number 2: 1839225; Supplier 3: Newark; Supplier Part Number 3: 15N5477; Number of Outputs: 1; RoHS: TRUE; Vout Max(V): 20; Mounting Technology: Surface Mount; PartNumber: LT1963AMPQ#PBF; ComponentLink1Description: Manufacturer URL; ComponentLink1URL: http://www.linear.com/; ComponentLink2Description: Datasheet; ComponentLink2URL: http://cds.linear.com/docs/en/datasheet/1963afe.pdf; ComponentLink3Description: Package Specification; ComponentLink3URL: http://cds.linear.com/docs/en/packaging/Q%20DD5%2005-08-1461%20Rev%20F.pdf
U10 = ADG709: as U7 on sheet RTD; ManufacturerPartNumber: ADG709

## Sheet Current_Limit.SchDoc: LCL and inrush current limiter
size A4; Author: Grzegorz Gajoch; DocumentNumber: 8; SheetNumber: 8; SheetTotal: 16; Model: EM1; PageSetup: Record=PageOptions|CenterHorizontal=True|CenterVertical=True|PrintScale=0.52|XCorrection=1.00|YCorrection=1.00|PrintKind=1|BorderSize=5000000|LeftOffset=0|BottomOffset=0|Orientation=2|PaperLength=4200|PaperWidth=2970|Scale=100|PaperSource=7|PrintQuality=600|MediaType=1|DitherType=10|PaperKind=A3|PrintScaleMode=1; Res: 180R
Used 4 times, as channels Solar_interface/Current_Limit_CH0, Solar_interface/Current_Limit_CH1, Solar_interface/Current_Limit_CH2, Solar_interface/Current_Limit_CH3. Parts and nets are listed once, with the designators drawn on the sheet.
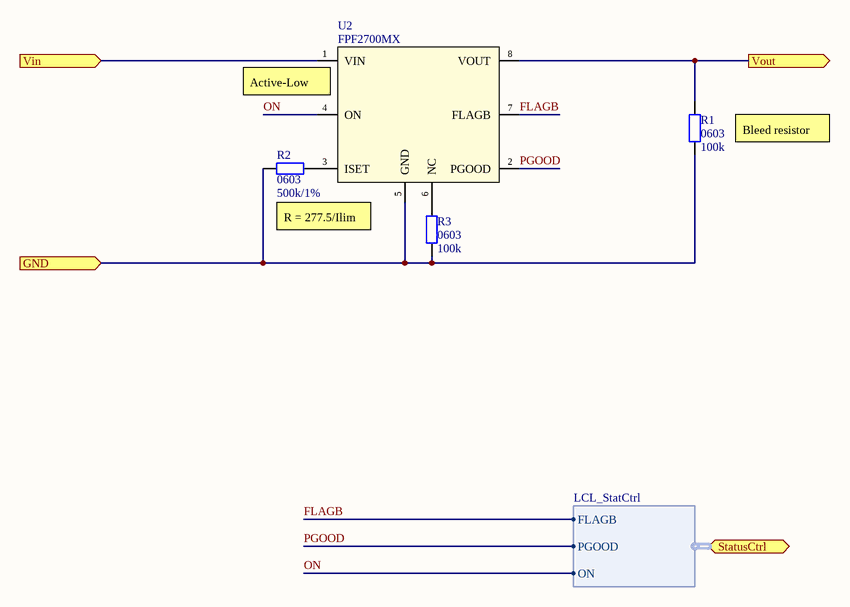
[diagram p6: Current_Limit.SchDoc]

### Parts
R1  0603  value 100k  [SMD_Resistor_0603]
R2  0603  value 500k/1%  [SMD_Resistor_0603]
R3  0603  value 100k  [SMD_Resistor_0603]
U2  FPF2700MX  [SOIC-8-N]

### Ports
GND (in), StatusCtrl (harness LCL_StatCtrl), Vin (in), Vout (out)

### Harnesses
LCL_StatCtrl: FLAGB, PGOOD, ON

### Nets
FLAGB: U2.7(FLAGB) ; port StatusCtrl.FLAGB
GND: R1.2 R2.1 R3.2 U2.5(GND) ; port GND
ON: U2.4(ON) ; port StatusCtrl.ON
PGOOD: U2.2(PGOOD) ; port StatusCtrl.PGOOD
Vin: U2.1(VIN) ; port Vin
Vout: R1.1 U2.8(VOUT) ; port Vout
NetR2_2: R2.2 U2.3(ISET)
NetR3_1: R3.1 U2.6(NC)

### Channels
Solar_interface/Current_Limit_CH0: designators end in _Current_Limit_CH0; ports GND=Ground1 Vin=NetC32_1 Vout=NetP7_1
Solar_interface/Current_Limit_CH1: designators end in _Current_Limit_CH1; ports GND=Ground1 Vin=NetC32_1 Vout=NetP8_1
Solar_interface/Current_Limit_CH2: designators end in _Current_Limit_CH2; ports GND=Ground1 Vin=NetC32_1 Vout=NetP9_1
Solar_interface/Current_Limit_CH3: designators end in _Current_Limit_CH3; ports GND=Ground1 Vin=NetC32_1 Vout=NetP10_1

### Notes on the sheet
- (near U2) Active-Low
- (near R1) Bleed resistor
- R = 277.5/Ilim
- Title:
- Sheet:
- of
- Author:
- Model:
- Document Number:
- Checked by:
- Iss-Rev:
- Approved by:
- Date:
- File name:

### Library data of the parts
R1-R3 = Res2: Resistor; Published: 8-Jun-2000; LatestRevisionDate: 17-Jul-2002; LatestRevisionNote: Re-released for DXP Platform.; PackageReference: AXIAL-0.4; Publisher: Altium Limited; PackageDescription: Axial Device, Thru-Hole; 2 Leads; 0.4 in Pin Spacing
U2 = FPF2700MX: Adj over-current protection 0.4-2A, Load Switch; Manufacturer: Fairchild Semiconductor; Value: FPF2700MX

## Sheet ReferenceVoltage.SchDoc: Precision, low drift, 2.5V Reference Voltage
size A4; Author: M. Gumiela, G. Gajoch; DocumentNumber: 11; SheetNumber: 11; SheetTotal: 16; Model: EM1; PageSetup: Record=PageOptions|CenterHorizontal=True|CenterVertical=True|PrintScale=0.52|XCorrection=1.00|YCorrection=1.00|PrintKind=1|BorderSize=5000000|LeftOffset=0|BottomOffset=0|Orientation=2|PaperLength=4200|PaperWidth=2970|Scale=100|PaperSource=7|PrintQuality=600|MediaType=1|DitherType=10|PaperKind=A3|PrintScaleMode=1
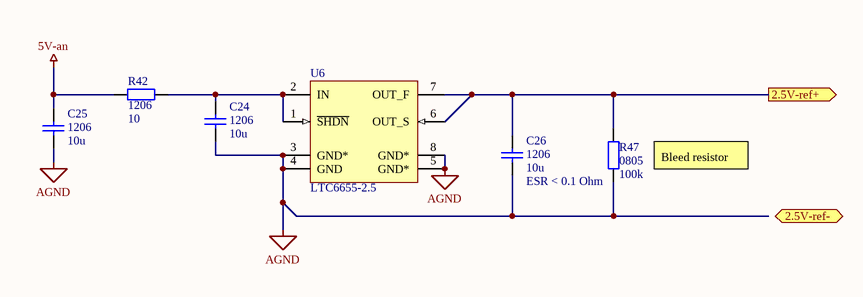
[diagram p7: ReferenceVoltage.SchDoc]

### Parts
C24  1206  value 10u  [SMD_Capacitor_1206]
C25  1206  value 10u  [SMD_Capacitor_1206]
C26  ESR < 0.1 Ohm  value 10u  [SMD_Capacitor_1206]
R42  1206  value 10  [SMD_Resistor_1206]
R47  0805  value 100k  [SMD_Resistor_0805]
U6  LTC6655-2.5  [MSOP-8]

### Ports
2.5V-ref+ (out), 2.5V-ref- (in)

### Nets
5V-an: C25.2 R42.1  [project net Vcc1]
AGND: C24.1 C25.1 C26.1 R47.1 U6.3(GND*) U6.4(GND) U6.5(GND*) U6.8(GND*)  [project net Ground1]
2.5V-ref: C26.2 R47.2 U6.6(OUT_S) U6.7(OUT_F) ; port 2.5V-ref+
NetC24_2: C24.2 R42.2 U6.1(~{SHDN}) U6.2(IN)

### Notes on the sheet
- (near R47) Bleed resistor
- Title:
- Sheet:
- of
- Author:
- Model:
- Document Number:
- Checked by:
- Iss-Rev:
- Approved by:
- Date:
- File name:

### Library data of the parts
C24-C26 = Cap: Capacitor; Published: 8-Jun-2000; LatestRevisionDate: 17-Jul-2002; LatestRevisionNote: Re-released for DXP Platform.; PackageReference: RAD-0.3; Publisher: Altium Limited; PackageDescription: Radial Cap, Thru-Hole; 2 Leads; 0.3 in Pin Spacing
R42 R47 = Res2: Resistor; Published: 8-Jun-2000; LatestRevisionDate: 17-Jul-2002; LatestRevisionNote: Re-released for DXP Platform.; PackageReference: AXIAL-0.4; Publisher: Altium Limited; PackageDescription: Axial Device, Thru-Hole; 2 Leads; 0.4 in Pin Spacing
U6 = LTC6655-2.5: 0.25ppm Noise, Low Drift  Precision References; PartNumber: LTC6655-2.5; ComponentLink1Description: Manufacturer URL; ComponentLink1URL: http://www.linear.com/; ComponentLink2Description: Datasheet; ComponentLink2URL: http://cds.linear.com/docs/en/datasheet/6655fe.pdf

## Sheet ADC.SchDoc: 24-bit Analog to Digital converter
size A4; Author: Grzegorz Gajoch; DocumentNumber: 7; SheetNumber: 7; SheetTotal: 16; Model: EM1; PageSetup: Record=PageOptions|CenterHorizontal=True|CenterVertical=True|PrintScale=0.52|XCorrection=1.00|YCorrection=1.00|PrintKind=1|BorderSize=5000000|LeftOffset=0|BottomOffset=0|Orientation=2|PaperLength=4200|PaperWidth=2970|Scale=100|PaperSource=7|PrintQuality=600|MediaType=1|DitherType=10|PaperKind=A3|PrintScaleMode=1
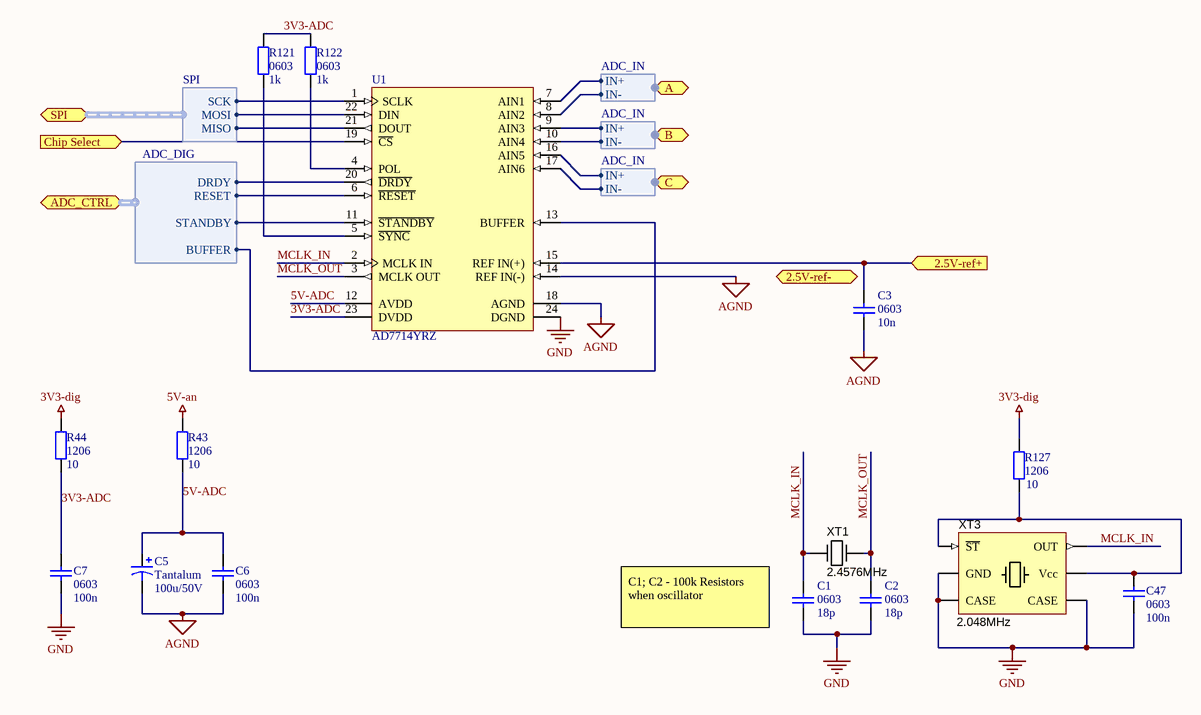
[diagram p8: ADC.SchDoc]

### Parts
C1  0603  value 18p  [SMD_Capacitor_0603]
C2  0603  value 18p  [SMD_Capacitor_0603]
C3  0603  value 10n  [SMD_Capacitor_0603]
C5  Tantalum  value 100u/50V  [Tantalum_cap_D]
C6  0603  value 100n  [SMD_Capacitor_0603]
C7  0603  value 100n  [SMD_Capacitor_0603]
C47  0603  value 100n  [SMD_Capacitor_0603]
R43  1206  value 10  [SMD_Resistor_1206]
R44  1206  value 10  [SMD_Resistor_1206]
R121  0603  value 1k  [SMD_Resistor_0603]
R122  0603  value 1k  [SMD_Resistor_0603]
R127  1206  value 10  [SMD_Resistor_1206]
U1  AD7714YRZ  [RW-24_M]
XT1  2.4576MHz  [HC49U]
XT3  2.048MHz  [SG7050]

### Ports
2.5V-ref+ (in), 2.5V-ref- (out), A (harness ADC_IN), ADC_CTRL (harness ADC_DIG), B (harness ADC_IN), C (harness ADC_IN), Chip Select (in), SPI (harness SPI)

### Harnesses
ADC_DIG: DRDY, RESET, STANDBY, BUFFER
ADC_IN: IN+, IN-
SPI: MOSI, MISO, SCK

### Nets
3V3-dig: R44.1 R127.2  [project net Vcc3]
5V-an: R43.1  [project net Vcc1]
AGND: C1.1 C2.1 C3.1 C5.2 C6.1 C7.1 C47.2 U1.14(REF_IN(-)) U1.18(AGND) U1.24(DGND) XT3.2(CASE) XT3.3(GND) XT3.5(CASE)  [also labelled GND]  [project net Ground1]
2.5V-ref: C3.2 U1.8(AIN2) U1.10(AIN4) U1.15(REF_IN(+)) ; port 2.5V-ref+, port B.IN-, port A.IN-
3V3-ADC: C7.2 R44.2 R121.1 R122.1 U1.23(DVDD)
5V-ADC: C5.1 C6.2 R43.2 U1.12(AVDD)
CS_ADC_I: U1.19(~{CS}) ; port Chip Select
MCLK_IN: C1.2 U1.2(MCLK_IN) XT1.1(IN) XT3.4(OUT)
MCLK_OUT: C2.2 U1.3(MCLK_OUT) XT1.2(OUT)
MISO_ADC: U1.21(DOUT) ; port SPI.MISO
NetC47_1: C47.1 R127.1 XT3.1(~{ST}) XT3.6(Vcc)
NetR17_2: U1.20(~{DRDY}) ; port ADC_CTRL.DRDY
NetR19_2: U1.6(~{RESET}) ; port ADC_CTRL.RESET
NetR20_2: U1.11(~{STANDBY}) ; port ADC_CTRL.STANDBY
NetR21_2: U1.13(BUFFER) ; port ADC_CTRL.BUFFER
NetR53_RTD_interface#1_1: U1.7(AIN1) ; port A.IN+
NetR53_RTD_interface#2_1: U1.9(AIN3) ; port B.IN+
NetR79_2: U1.16(AIN5) ; port C.IN+
NetR98_2: U1.1(SCLK) ; port SPI.SCK
NetR99_2: U1.22(DIN) ; port SPI.MOSI
NetR121_2: R121.2 U1.5(~{SYNC})
NetR122_2: R122.2 U1.4(POL)
NetU1_17: U1.17(AIN6) ; port C.IN-

### Notes on the sheet
- (near C1) C1; C2 - 100k Resistors when oscillator
- Title:
- Sheet:
- of
- Author:
- Model:
- Document Number:
- Checked by:
- Iss-Rev:
- Approved by:
- Date:
- File name:

### Library data of the parts
C1-C3 C6 C7 C47 = Cap1: Capacitor; Published: 8-Jun-2000; LatestRevisionDate: 17-Jul-2002; LatestRevisionNote: Re-released for DXP Platform.; PackageReference: RAD-0.3; Publisher: Altium Limited; PackageDescription: Radial Cap, Thru-Hole; 2 Leads; 0.3 in Pin Spacing
C5 = Cap Pol1: Polarized Capacitor (Radial); Published: 8-Jun-2000; LatestRevisionDate: 17-Jul-2002; LatestRevisionNote: Re-released for DXP Platform.; PackageReference: RB7.6-15; Publisher: Altium Limited; PackageDescription: Polarized Capacitor (Radial); 2 Leads
R43 R44 R121 R122 R127 = Res2: Resistor; Published: 8-Jun-2000; LatestRevisionDate: 17-Jul-2002; LatestRevisionNote: Re-released for DXP Platform.; PackageReference: AXIAL-0.4; Publisher: Altium Limited; PackageDescription: Axial Device, Thru-Hole; 2 Leads; 0.4 in Pin Spacing
U1 = AD7714YRZ: 5 Channel 24-Bit Signal Conditioning Analog-to-Digital Converter with Serial, SPI Interface, 500 uA, CMOS, 3 V / 5 V, 1KSPS, -40 to +105 degC, RW-24, Pb-Free, Tube; Generic Part Number: AD7714; Manufacturer: Analog Devices; Resolution (Bits): 24; Channels: 5; Throughput Rate (SPS): 1K; Interface: Ser, SPI; DatasheetVersion: Rev.C; PackageVersion: 060706-A; PackageReference: RW-24; PackageDescription: 24-Lead Standard Small Outline Package [SOIC_W]; Supplier 1: Digi-Key; Supplier Part Number 1: AD7714YRZ-ND; Supplier 2: Farnell; Supplier Part Number 2: 1438858; Supplier 3: Newark; Supplier Part Number 3: 15P0854; Supplier 4: Newark; Supplier Part Number 4: 59K5335; Supplier 5: Mouser; Supplier Part Number 5: 584-AD7714YRZ; RoHS: Y; Packing: Tube; Mounting Technology: Surface Mount; Code_JEDEC: MS-013-AD; PartNumber: AD7714YRZ; ComponentLink1Description: Manufacturer URL; ComponentLink1URL: http://www.analog.com/en/index.html; ComponentLink2Description: Datasheet; ComponentLink2URL: http://www.analog.com/static/imported-files/data_sheets/AD7714.pdf; ComponentLink3Description: Package Specification; ComponentLink3URL: http://www.analog.com/static/imported-files/packages/33665150946139RW_24.pdf; ComponentLink4Description: Product URL; ComponentLink4URL: http://www.analog.com/en/analog-to-digital-converters/ad-converters/ad7714/products/product.html
XT1 = Crystal: AKER  C-2.4576-18-3050-X; Manufacturer 1: Citizen Finetech Miyota; Manufacturer Part Number 1: CMR309T-6.000MABJ-UT; Ratings: 6.00 MHz; Frequency: 6MHz; Frequency Stability: ±50ppm; Frequency Tolerance: ±30ppm; Load Capacitance: 18pF; Operating Mode: Fundamental; SCDType: spec; Package / Case: Cylindrical Can, Radial; Type: MHz Crystal; Operating Temperature: -10°C ~ 60°C; Mounting Type: Surface Mount; Size / Dimension: 0.118" Dia x 0.346" L (3.00mm x 8.80mm); Height: 0.122" (3.10mm); Supplier 1: Digi-Key; Supplier Part Number 1: 300-8348-1-ND; Tolerance: ±50ppm; ComponentLink1URL: http://media.digikey.com/pdf/Data%20Sheets/Citizen%20PDFs/CMR310T%20CMR309T.pdf; ComponentLink1Description: http://media.digikey.com/pdf/Data%20Sheets/Citizen%20PDFs/CMR310T%20CMR309T.pdf; Value: 2.4576MHz
XT3 = Crystal Oscillator: Manufacturer 1: Citizen Finetech Miyota; Manufacturer Part Number 1: CMR309T-6.000MABJ-UT; Ratings: 6.00 MHz; Frequency Stability: ±50ppm; Frequency Tolerance: ±30ppm; Load Capacitance: 15pF max.; Operating Mode: Fundamental; SCDType: spec; Package / Case: Cylindrical Can, Radial; Type: MHz Crystal; Frequency: 2.048MHz; Operating Temperature: -10°C ~ 60°C; Mounting Type: Surface Mount; Size / Dimension: 0.118" Dia x 0.346" L (3.00mm x 8.80mm); Height: 0.122" (3.10mm); Supplier 1: Digi-Key; Supplier Part Number 1: 300-8348-1-ND; Tolerance: ±50ppm; ComponentLink1URL: http://www.farnell.com/datasheets/1841779.pdf; ComponentLink1Description: http://pl.farnell.com/epson/x1g0044810050-sg7050can-2-048-mhz/oscillator-spxo-sg7050can-2-048/dp/2442953; Value: 2.048MHz

## Sheet PowerManagement.SchDoc: Power Management
size A4; Author: Grzegorz Gajoch; DocumentNumber: 3; SheetNumber: 3; SheetTotal: 16; Model: EM1; PageSetup: Record=PageOptions|CenterHorizontal=True|CenterVertical=True|PrintScale=0.52|XCorrection=1.00|YCorrection=1.00|PrintKind=1|BorderSize=5000000|LeftOffset=0|BottomOffset=0|Orientation=2|PaperLength=4200|PaperWidth=2970|Scale=100|PaperSource=7|PrintQuality=600|MediaType=1|DitherType=10|PaperKind=A3|PrintScaleMode=1
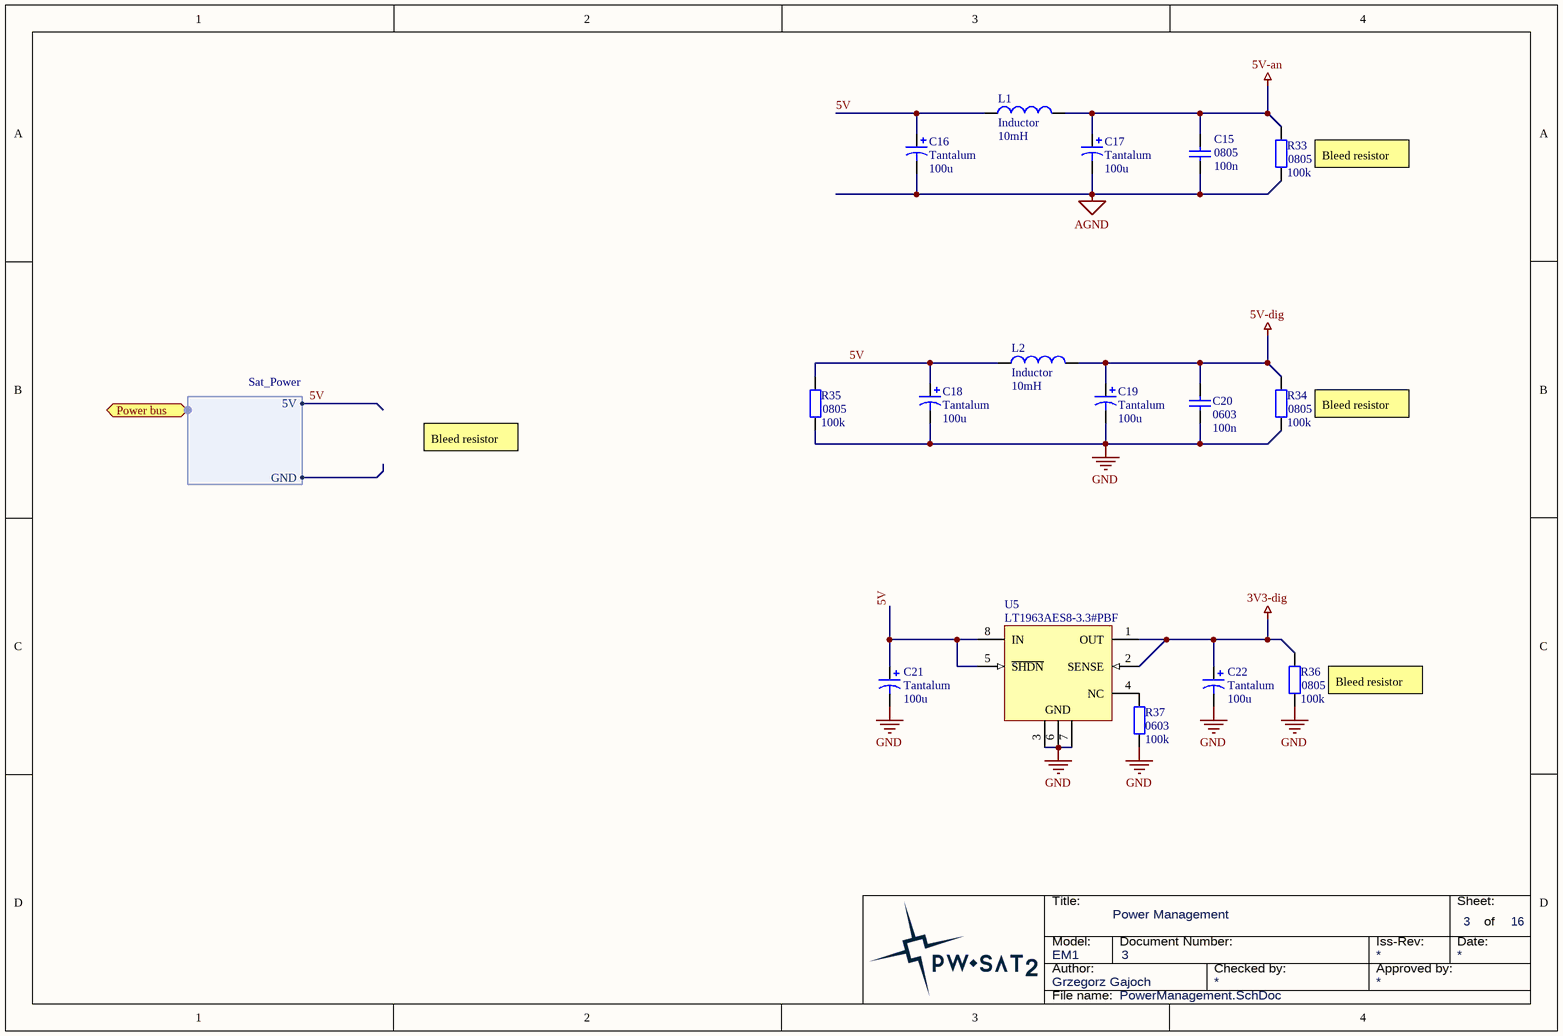
[diagram p9: PowerManagement.SchDoc]

### Parts
C15  0805  value 100n  [SMD_Capacitor_0805]
C16  Tantalum  value 100u  [Tantalum_cap_D]
C17  Tantalum  value 100u  [Tantalum_cap_D]
C18  Tantalum  value 100u  [Tantalum_cap_D]
C19  Tantalum  value 100u  [Tantalum_cap_D]
C20  0603  value 100n  [SMD_Capacitor_0603]
C21  Tantalum  value 100u  [Tantalum_cap_D]
C22  Tantalum  value 100u  [Tantalum_cap_D]
L1  Inductor  value 10mH  [SMD_Capacitor_0805]
L2  Inductor  value 10mH  [SMD_Capacitor_0805]
R33  0805  value 100k  [SMD_Resistor_0805]
R34  0805  value 100k  [SMD_Resistor_0805]
R35  0805  value 100k  [SMD_Resistor_0805]
R36  0805  value 100k  [SMD_Resistor_0805]
R37  0603  value 100k  [SMD_Resistor_0603]
U5  LT1963AES8-3.3#PBF  [LT-S8-8_N]

### Ports
Power bus (harness Sat_Power)

### Harnesses
Sat_Power: 5V, GND

### Nets
3V3-dig: C22.1 R36.2 U5.1(OUT) U5.2(SENSE)  [project net Vcc3]
5V-an: C15.2 C17.1 L1.2 R33.2  [project net Vcc1]
5V-dig: C19.1 C20.2 L2.2 R34.2
AGND: C15.1 C16.2 C17.2 C18.2 C19.2 C20.1 C21.2 C22.2 R33.1 R34.1 R35.1 R36.1 R37.1 U5.3(GND) U5.6(GND) U5.7(GND)  [also labelled GND]  [project net Ground1]
5V: C16.1 C18.1 C21.1 L1.1 L2.1 R35.2 U5.5(~{SHDN}) U5.8(IN) ; port Power bus.5V
NetR37_2: R37.2 U5.4(NC)

### Notes on the sheet
- (near R33) Bleed resistor
- Bleed resistor
- (near R34) Bleed resistor
- (near R36) Bleed resistor
- Title:
- Sheet:
- of
- Author:
- Model:
- Document Number:
- Checked by:
- Iss-Rev:
- Approved by:
- Date:
- File name:

### Library data of the parts
C15 C20 = Cap: Capacitor; Published: 8-Jun-2000; LatestRevisionDate: 17-Jul-2002; LatestRevisionNote: Re-released for DXP Platform.; PackageReference: RAD-0.3; Publisher: Altium Limited; PackageDescription: Radial Cap, Thru-Hole; 2 Leads; 0.3 in Pin Spacing
C16-C19 C21 C22 = Cap Pol1: Polarized Capacitor (Radial); Published: 8-Jun-2000; LatestRevisionDate: 17-Jul-2002; LatestRevisionNote: Re-released for DXP Platform.; PackageReference: RB7.6-15; Publisher: Altium Limited; PackageDescription: Polarized Capacitor (Radial); 2 Leads
L1 L2 = Inductor: Code_IEC: 1005; Published: 8-Jun-2000; LatestRevisionDate: 29-May-2009; LatestRevisionNote: IPC-7351 Footprint Added.; PackageReference: 0402-A; Publisher: Altium Limited; PackageDescription: Chip Inductor; Code_JEITA: 0402
R33-R37 = Res2: Resistor; Published: 8-Jun-2000; LatestRevisionDate: 17-Jul-2002; LatestRevisionNote: Re-released for DXP Platform.; PackageReference: AXIAL-0.4; Publisher: Altium Limited; PackageDescription: Axial Device, Thru-Hole; 2 Leads; 0.4 in Pin Spacing
U5 = LT1963AES8-3.3#PBF: 1.5 A, Low Noise, Fast Transient Response LDO Regulator, 2.1 to 20 V Vin, 3.3 V Vout, 8-pin SOIC (S8-8), -40 to 125 degC, Pb-Free; Manufacturer: Linear Technology; Discrete Pass Element: no; Dropout Voltage(V): 0.34; Iout(mA): 1500; Isupply(mA): 1; Noise(uV): 40; Output Voltage: 3.3 V; PSRR(dB): 63; Shutdown Current(uA): 0.01; Vin Max(V): 20; Vin Min(V): 2.1; DatasheetVersion: Rev. E; PackageVersion: Rev. G, 03/2012; PackageReference: S8-8; PackageDescription: 8-Pin Plastic Small Outline (Narrow .150 Inch), Body 4.9 x 3.9 mm, Pitch 1.27 mm; Supplier 1: Digi-Key; Supplier Part Number 1: LT1963AES8-3.3#PBF-ND; Supplier 2: Farnell; Supplier Part Number 2: 1273628; Supplier 3: Newark; Supplier Part Number 3: 57M7476; Number of Outputs: 1; RoHS: TRUE; Mounting Technology: Surface Mount; PartNumber: LT1963AES8-3.3#PBF; ComponentLink1Description: Manufacturer URL; ComponentLink1URL: http://www.linear.com/; ComponentLink2Description: Datasheet; ComponentLink2URL: http://cds.linear.com/docs/en/datasheet/1963afe.pdf; ComponentLink3Description: Package Specification; ComponentLink3URL: http://cds.linear.com/docs/en/packaging/05081610_G_SO8.pdf